# EAGLE design carChargeChannel (EAGLE 7.7.0)

## Sheet 1 of 2
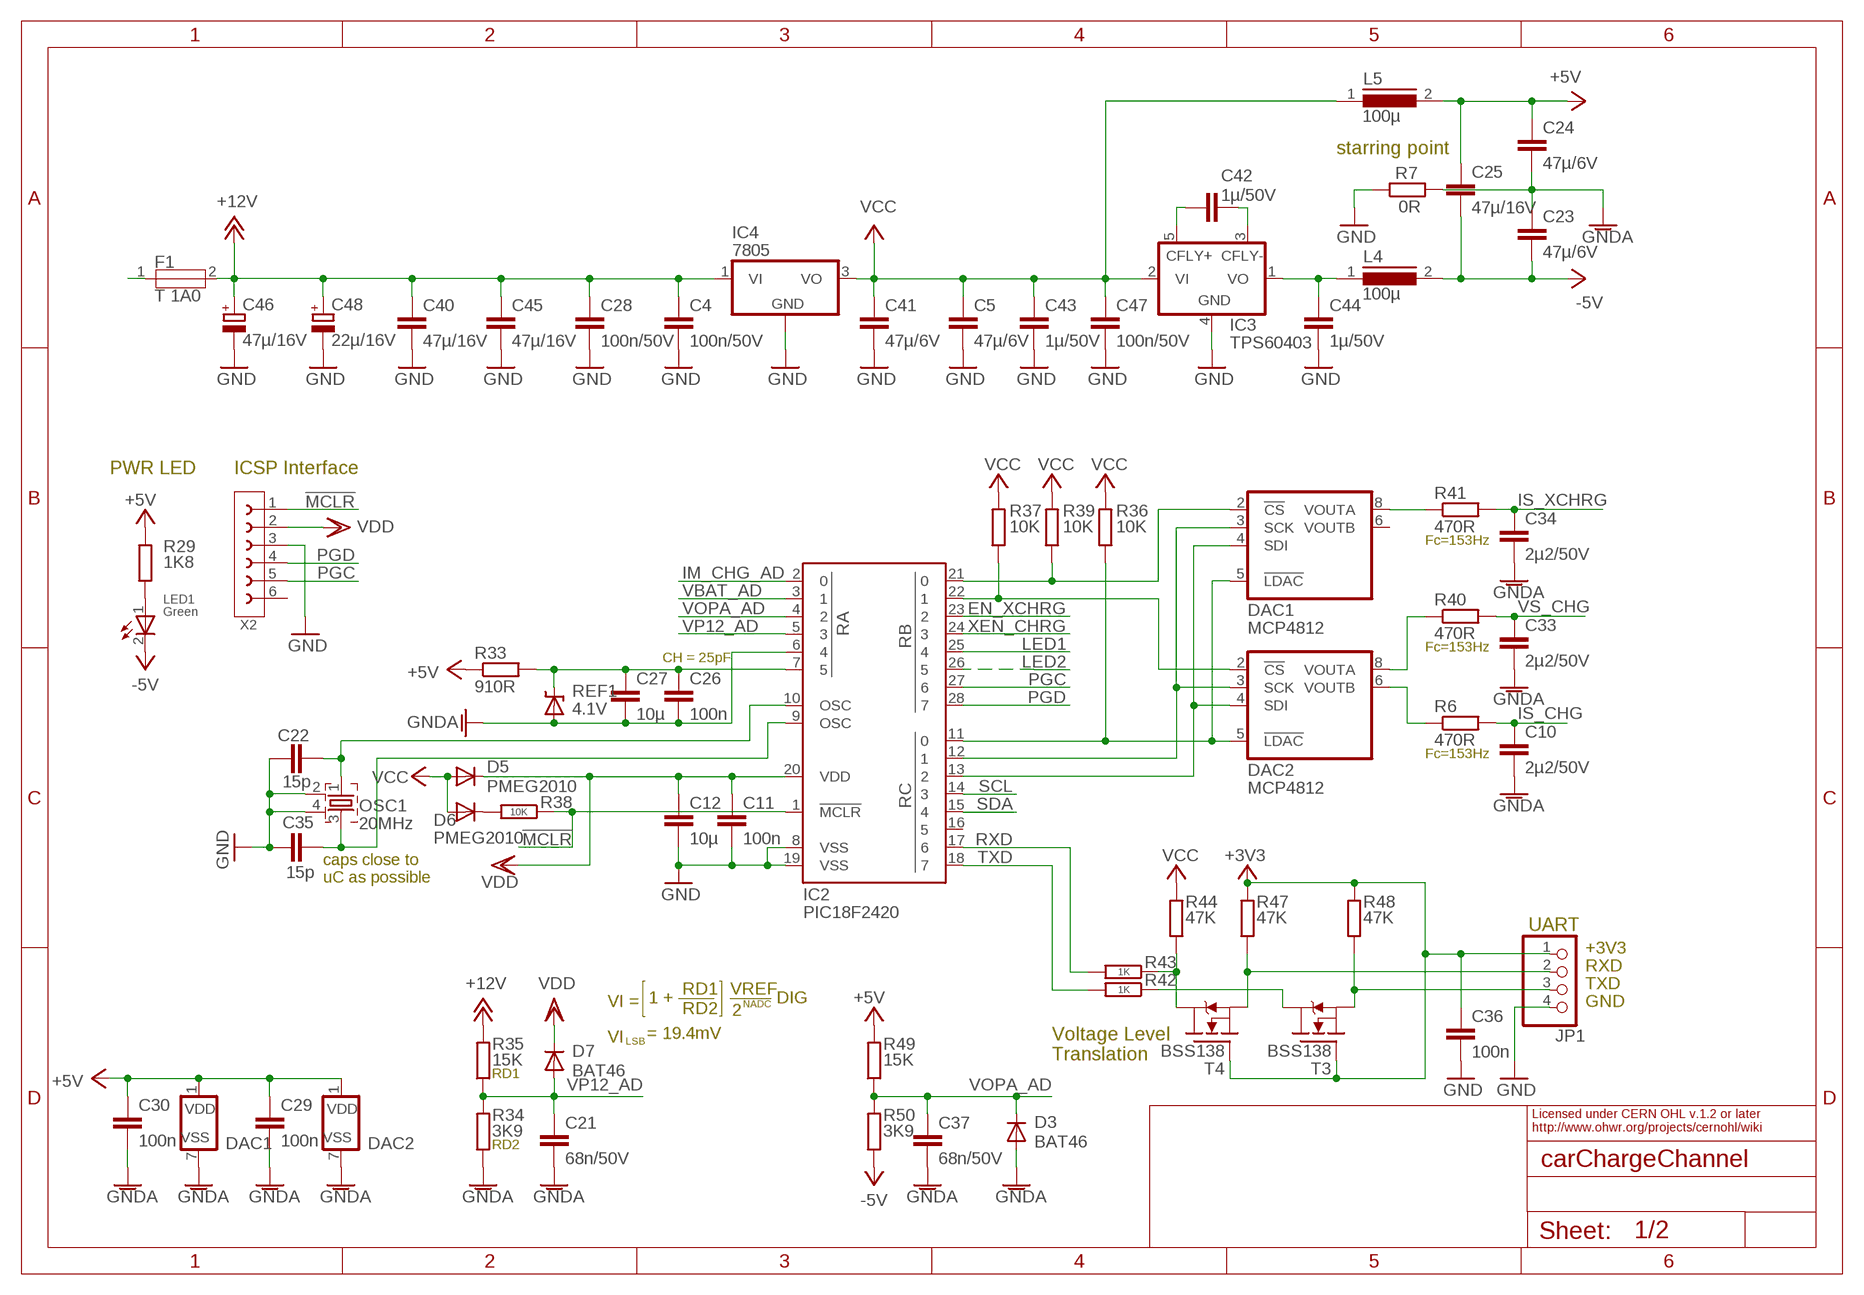
[diagram p0: schematic, sheet 1]

### Parts
C4  100n/50V  X7R-100000P-1206  [1206]
C5  47µ/6V  X5R-47000000P-1206  [1206]
C10  2µ2/50V  X7R-2200000P-1206  [1206]
C11  100n  X7R-100000P-1206  [1206]
C12  10µ  X7R-10000000P-1206  [1206]
C21  68n/50V  X7R-68000P-1206  [1206]
C22  15p  NP0-15P-1206  [1206]
C23  47µ/6V  X5R-47000000P-1206  [1206]
C24  47µ/6V  X5R-47000000P-1206  [1206]
C25  47µ/16V  X5R-47000000P-1210  [1210]
C26  100n  X7R-100000P-1206  [1206]
C27  10µ  X7R-10000000P-1206  [1206]
C28  100n/50V  X7R-100000P-1206  [1206]
C29  100n  X7R-100000P-1206  [1206]
C30  100n  X7R-100000P-1206  [1206]
C33  2µ2/50V  X7R-2200000P-1206  [1206]
C34  2µ2/50V  X7R-2200000P-1206  [1206]
C35  15p  NP0-15P-1206  [1206]
C36  100n  X7R-100000P-1206  [1206]
C37  68n/50V  X7R-68000P-1206  [1206]
C40  47µ/16V  X5R-47000000P-1210  [1210]
C41  47µ/6V  X5R-47000000P-1206  [1206]
C42  1µ/50V  X7R-1000000P-1206  [1206]
C43  1µ/50V  X7R-1000000P-1206  [1206]
C44  1µ/50V  X7R-1000000P-1206  [1206]
C45  47µ/16V  X5R-47000000P-1210  [1210]
C46  47µ/16V  AEC-47U-16V-C  [PANC]
C47  100n/50V  X7R-100000P-1206  [1206]
C48  22µ/16V  AEC-22U-16V-B  [PANB]
D3  BAT46  BAT46W  [SOD123]
D5  PMEG2010  PMEGXX10-20VBEA  [SOD323]
D6  PMEG2010  PMEGXX10-20VBEA  [SOD323]
D7  BAT46  BAT46W  [SOD123]
DAC1  MCP4812  MCP4812-E/MS  [MSOP8]
DAC2  MCP4812  MCP4812-E/MS  [MSOP8]
F1  T 1A0  OMT-T1A0-125V  [OMT125]
IC2  PIC18F2420  PIC18F2420/SO  [SOIC28-7.62]
IC3  TPS60403  TPS60403DBVT  [SOT23-5]
IC4  7805  MC7805D2T  [TO263]
JP1  PINHD-1X4  [1X04]
L4  100µ  LQH3C101K  [1210]
L5  100µ  LQH3C101K  [1210]
LED1  Green  LEDMONO-GREEN-KP3216  [LED3216]
OSC1  20MHz  MT-20000  [MT]
R6  470R  RC1206-470  [1206]
R7  0R  R1206-0.0-1%  [1206]
R29  1K8  R1206-1800-1%  [1206]
R33  910R  R1206-910-1%  [1206]
R34  3K9  R1206-3900-1%  [1206]
R35  15K  R1206-15000-1%  [1206]
R36  10K  R1206-10000-1%  [1206]
R37  10K  R1206-10000-1%  [1206]
R38  10K  R1206-10000-1%  [1206]
R39  10K  R1206-10000-1%  [1206]
R40  470R  RC1206-470  [1206]
R41  470R  RC1206-470  [1206]
R42  1K  R1206-1000-1%  [1206]
R43  1K  R1206-1000-1%  [1206]
R44  47K  R1206-47000-1%  [1206]
R47  47K  R1206-47000-1%  [1206]
R48  47K  R1206-47000-1%  [1206]
R49  15K  R1206-15000-1%  [1206]
R50  3K9  R1206-3900-1%  [1206]
REF1  4.1V  LM4040-4.1V-MF03A  [SOT23]
T3  BSS138  [SOT23]
T4  BSS138  [SOT23]
X2  2X3  BOXHD-06-S-2.54  [BOXHD-06-2.54-S]

### Nets
!CS_DAC1: DAC1.2(!CS) IC2.21 R39.1
!CS_DAC2: DAC2.2(!CS) IC2.22 R37.1
!MCLR: IC2.1(!MCLR) R38.1 X2.1
+3V3: C36.1 JP1.1 R47.2 R48.2 T3.1(G) T4.1(G)
+5V: C24.1 C25.1 C29.1 C30.1 DAC1.1(VDD) DAC2.1(VDD) L5.2 R29.2 R33.1 R49.2 ; also sheet 2
+12V: C4.1 C28.1 C40.1 C45.1 C46.CP(+) C48.CP(+) F1.2 IC4.1(VI) R35.2 ; also sheet 2
-5V: C23.2 C25.2 L4.2 LED1.2(C) R50.1 ; also sheet 2
EN_XCHRG: IC2.23 ; also sheet 2
GND: C4.2 C5.2 C11.2 C12.2 C22.2 C28.2 C35.2 C36.2 C40.2 C41.2 C43.2 C44.2 C45.2 C46.CN(-) C47.2 C48.CN(-) IC2.8(VSS) IC2.19(VSS) IC3.4(GND) IC4.4(GND) JP1.4 OSC1.2 OSC1.4 R7.1 X2.3 ; also sheet 2
GNDA: C10.2 C21.2 C23.1 C24.2 C26.2 C27.2 C29.2 C30.2 C33.2 C34.2 C37.2 D3.A DAC1.7(VSS) DAC2.7(VSS) IC2.6 R7.2 R34.1 REF1.1(A) ; also sheet 2
IM_CHG_AD: IC2.2 ; also sheet 2
IS_CHG: C10.1 R6.2 ; also sheet 2
IS_XCHRG: C34.1 R41.2 ; also sheet 2
LED1: IC2.25 ; also sheet 2
LED2: IC2.26 ; also sheet 2
N$10: DAC1.4(SDI) DAC2.4(SDI) IC2.13
N$20: DAC1.3(SCK) DAC2.3(SCK) IC2.12
N$22: C42.2 IC3.3(CFLY-)
N$28: C42.1 IC3.5(CFLY+)
N$29: DAC2.6(VOUTB) R6.1
N$31: DAC2.8(VOUTA) R40.1
N$32: DAC1.8(VOUTA) R41.1
N$33: C44.1 IC3.1(VO) L4.1
N$34: C35.1 IC2.9(OSC) OSC1.3
N$35: C22.1 IC2.10(OSC) OSC1.1
N$36: LED1.1(A) R29.1
N$37: DAC1.5(!LDAC) DAC2.5(!LDAC) IC2.11 R36.1
N$39: D6.C R38.2
N$40: F1.1
N$45: JP1.3 R48.1 T3.2(S)
N$46: JP1.2 R47.1 T4.2(S)
N$47: R42.1 T3.3(D)
N$48: R43.1 R44.1 T4.3(D)
PGC: IC2.27 X2.5
PGD: IC2.28 X2.4
RXD: IC2.17 R43.2
SCL: IC2.14
SDA: IC2.15
TXD: IC2.18 R42.2
VBAT_AD: IC2.3 ; also sheet 2
VCC: C5.1 C41.1 C43.1 C47.1 D5.A D6.A IC3.2(VI) IC4.3(VO) L5.1 R36.2 R37.2 R39.2 R44.2
VDD: C11.1 C12.1 D5.C D7.C IC2.20(VDD) X2.2
VOPA_AD: C37.1 D3.C IC2.4 R49.1 R50.2
VP12_AD: C21.1 D7.A IC2.5 R34.2 R35.1
VREF_ADC: C26.1 C27.1 IC2.7 R33.2 REF1.2(C)
VS_CHG: C33.1 R40.2 ; also sheet 2
XEN_CHRG: IC2.24 ; also sheet 2
Unconnected: DAC1.6(VOUTB) IC2.16 X2.6

### Notes on the sheet
- starring point
- PWR LED | ICSP Interface
- Fc=153Hz
- Fc=153Hz
- CH = 25pF
- Fc=153Hz
- caps close to
  uC as possible
- UART
- +3V3
- RXD
- TXD
- RD1 | VREF
- VI | = | 1 + | DIG
- NADC | GND
- RD2 | 2
- VI | = 19.4mV
- LSB
- Voltage Level
  Translation
- RD1
- Licensed under CERN OHL v.1.2 or later
  http://www.ohwr.org/projects/cernohl/wiki
- RD2

## Sheet 2 of 2
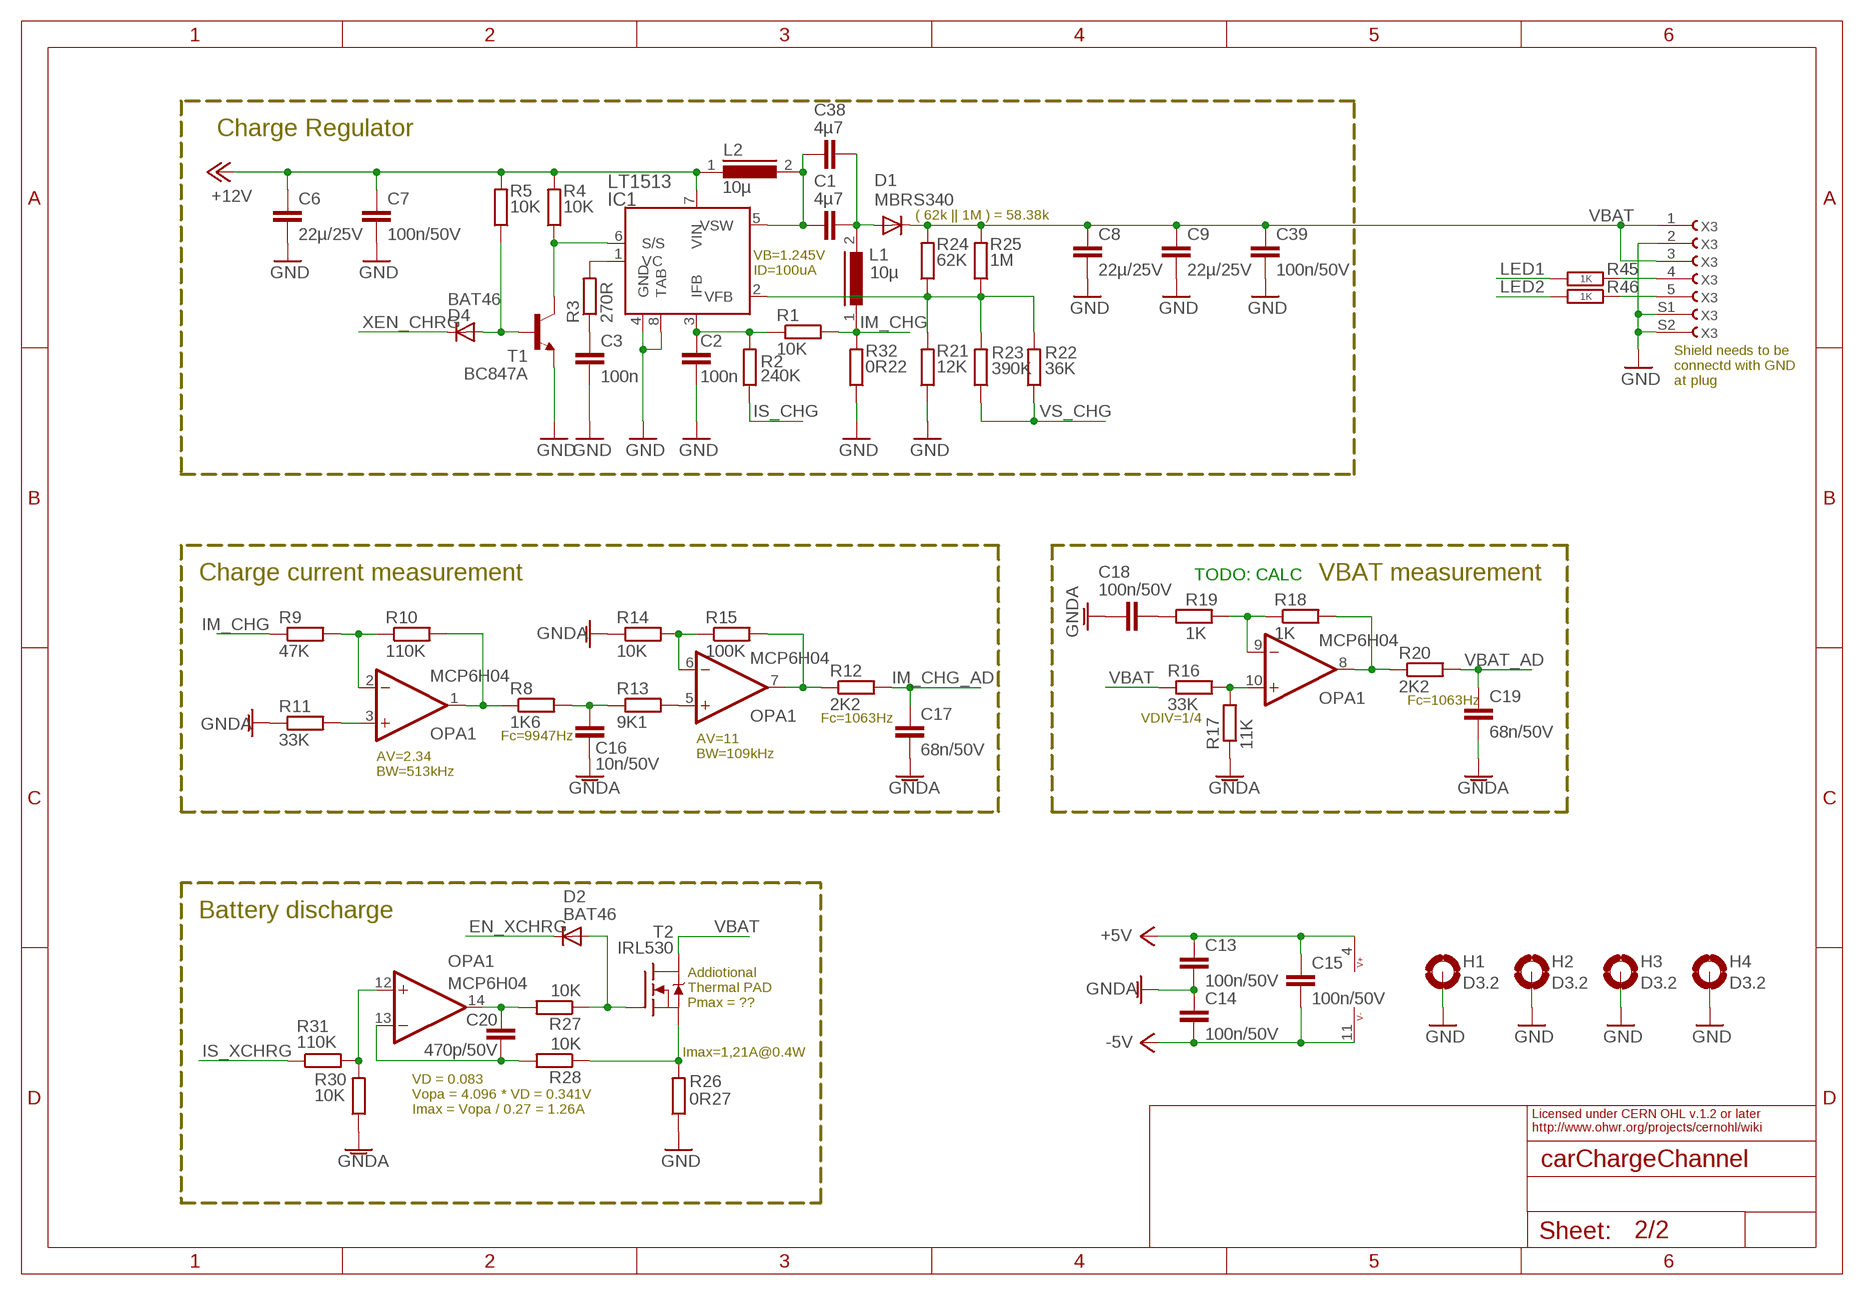
[diagram p1: schematic, sheet 2]

### Parts
C1  4µ7  X7R-4700000P-1206  [1206]
C2  100n  X7R-100000P-1206  [1206]
C3  100n  X7R-100000P-1206  [1206]
C6  22µ/25V  X5R-22000000P-1210  [1210]
C7  100n/50V  X7R-100000P-1206  [1206]
C8  22µ/25V  X5R-22000000P-1210  [1210]
C9  22µ/25V  X5R-22000000P-1210  [1210]
C13  100n/50V  X7R-100000P-1206  [1206]
C14  100n/50V  X7R-100000P-1206  [1206]
C15  100n/50V  X7R-100000P-1206  [1206]
C16  10n/50V  X7R-10000P-1206  [1206]
C17  68n/50V  X7R-68000P-1206  [1206]
C18  100n/50V  X7R-100000P-1206  [1206]
C19  68n/50V  X7R-68000P-1206  [1206]
C20  470p/50V  NP0-470P-1206  [1206]
C38  4µ7  X7R-4700000P-1206  [1206]
C39  100n/50V  X7R-100000P-1206  [1206]
D1  MBRS340  [DO214AB]
D2  BAT46  BAT46W  [SOD123]
D4  BAT46  BAT46W  [SOD123]
H1  D3.2  MOUNT-PAD-ROUND3.2  [3,2-PAD]
H2  D3.2  MOUNT-PAD-ROUND3.2  [3,2-PAD]
H3  D3.2  MOUNT-PAD-ROUND3.2  [3,2-PAD]
H4  D3.2  MOUNT-PAD-ROUND3.2  [3,2-PAD]
IC1  LT1513  LT1513CR  [TO263-7]
L1  10µ  DR-10U-74  [DR74]
L2  10µ  DR-10U-74  [DR74]
OPA1  MCP6H04  [SOIC14]
R1  10K  R1206-10000-1%  [1206]
R2  240K  R1206-240000-1%  [1206]
R3  270R  R1206-270-1%  [1206]
R4  10K  R1206-10000-1%  [1206]
R5  10K  R1206-10000-1%  [1206]
R8  1K6  R1206-1600-1%  [1206]
R9  47K  R1206-47000-1%  [1206]
R10  110K  R1206-110000-1%  [1206]
R11  33K  R1206-33000-1%  [1206]
R12  2K2  R1206-2200-1%  [1206]
R13  9K1  R1206-9100-1%  [1206]
R14  10K  R1206-10000-1%  [1206]
R15  100K  R1206-100000-1%  [1206]
R16  33K  R1206-33000-1%  [1206]
R17  11K  R1206-11000-1%  [1206]
R18  1K  R1206-1000-1%  [1206]
R19  1K  R1206-1000-1%  [1206]
R20  2K2  R1206-2200-1%  [1206]
R21  12K  R1206-12000-1%  [1206]
R22  36K  R1206-36000-1%  [1206]
R23  390K  R1206-390000-1%  [1206]
R24  62K  R1206-62000-1%  [1206]
R25  1M  R1206-1000000-1%  [1206]
R26  0R27  R1206-0.27-5%  [1206]
R27  10K  R1206-10000-1%  [1206]
R28  10K  R1206-10000-1%  [1206]
R30  10K  R1206-10000-1%  [1206]
R31  110K  R1206-110000-1%  [1206]
R32  0R22  R1206-0.22-1%  [1206]
R45  1K  R1206-1000-1%  [1206]
R46  1K  R1206-1000-1%  [1206]
T1  BC847A  [SOT23]
T2  IRL530  IRL530NS  [TO263AB]
X3  DIN5  MAB-5S  [DIN5P]

### Nets
+5V: C13.1 C15.1 OPA1.4(V+) ; also sheet 1
+12V: C6.1 C7.1 IC1.7(VIN) L2.1 R4.2 R5.2 ; also sheet 1
-5V: C14.2 C15.2 OPA1.11(V-) ; also sheet 1
EN_XCHRG: D2.C ; also sheet 1
GND: C2.2 C3.2 C6.2 C7.2 C8.2 C9.2 C39.2 H1.B3,2(MOUNT) H2.B3,2(MOUNT) H3.B3,2(MOUNT) H4.B3,2(MOUNT) IC1.4(GND) IC1.8(TAB) R21.1 R26.1 R32.1 T1.2(E) X3.2 X3.S1 X3.S2 ; also sheet 1
GNDA: C13.2 C14.1 C16.2 C17.2 C18.1 C19.2 R11.1 R14.1 R17.1 R30.1 ; also sheet 1
IM_CHG: L1.1 R1.2 R9.1 R32.2
IM_CHG_AD: C17.1 R12.2 ; also sheet 1
IS_CHG: R2.1 ; also sheet 1
IS_XCHRG: R31.1 ; also sheet 1
LED1: R45.2 ; also sheet 1
LED2: R46.2 ; also sheet 1
N$1: C1.2 C38.2 D1.A L1.2
N$2: C1.1 C38.1 IC1.5(VSW) L2.2
N$3: OPA1.3(+IN) R11.2
N$4: OPA1.8(OUT) R18.2 R20.1
N$5: D4.A R5.1 T1.1(B)
N$6: C3.1 R3.1
N$7: IC1.1(VC) R3.2
N$8: C2.1 IC1.3(IFB) R1.1 R2.2
N$9: IC1.6(S/S) R4.1 T1.3(C)
N$11: OPA1.2(-IN) R9.2 R10.1
N$12: OPA1.1(OUT) R8.1 R10.2
N$13: C16.1 R8.2 R13.1
N$14: OPA1.5(+IN) R13.2
N$15: OPA1.6(-IN) R14.2 R15.1
N$16: OPA1.10(+IN) R16.2 R17.2
N$17: OPA1.7(OUT) R12.1 R15.2
N$18: OPA1.9(-IN) R18.1 R19.2
N$19: C18.2 R19.1
N$21: C20.1 OPA1.14(OUT) R27.2
N$23: D2.A R27.1 T2.1(G)
N$24: OPA1.12(+IN) R30.2 R31.2
N$25: C20.2 OPA1.13(-IN) R28.2
N$26: R26.2 R28.1 T2.3(S)
N$27: IC1.2(VFB) R21.2 R22.2 R23.2 R24.1 R25.1
N$41: R45.1 X3.4
N$42: R46.1 X3.5
VBAT: C8.1 C9.1 C39.1 D1.C R16.1 R24.2 R25.2 T2.4(D) X3.1 X3.3
VBAT_AD: C19.1 R20.2 ; also sheet 1
VS_CHG: R22.1 R23.1 ; also sheet 1
XEN_CHRG: D4.C ; also sheet 1

### Notes on the sheet
- Charge Regulator
- ( 62k || 1M ) = 58.38k
- VB=1.245V
  ID=100uA
- Shield needs to be
  connectd with GND
  at plug
- Charge current measurement | TODO: CALC | VBAT measurement
- Fc=1063Hz
- Fc=1063Hz | VDIV=1/4
- Fc=9947Hz
- AV=11
  BW=109kHz
- AV=2.34
  BW=513kHz
- Battery discharge
- Addiotional
  Thermal PAD
  Pmax = ??
- Imax=1,21A@0.4W
- VD = 0.083
  Vopa = 4.096 * VD = 0.341V
  Imax = Vopa / 0.27 = 1.26A
- Licensed under CERN OHL v.1.2 or later
  http://www.ohwr.org/projects/cernohl/wiki

## Library data of the parts
C1 C38 = omcCapacitor:X7R: X7R Ceramic Capacitors YAGEO Multilayer Capacitors For General Purpose Temperature characteristics: X7R Rated Voltage: 50V Operating Temperature Range: –55°C to +125°C Reichelt Datasheet <http://cdn-reichelt.de/documents/datenblatt/B300/X7R.pdf> MURATA GCM Series High Dielectric Constant Type Murata Datasheet <http://www.murata.com/~/media/webrenewal/support/library/catalog/products/capacitor/mlcc/c03e.ashx> Reichelt Datasheet <http://cdn-reichelt.de/documents/datenblatt/A900/DATASHEET_SMD_0805_1206_1210.pdf>; DIST#REICHELT#: X7R-G1206 4,7/50; VALUE: 4µ7/50V; VENDOR#: MURATA,GCM31CC71H475KA03
C2 C3 C11 C26 C29 C30 C36 = omcCapacitor:X7R: X7R Ceramic Capacitors YAGEO Multilayer Capacitors For General Purpose Temperature characteristics: X7R Rated Voltage: 50V Operating Temperature Range: –55°C to +125°C Reichelt Datasheet <http://cdn-reichelt.de/documents/datenblatt/B300/X7R.pdf> MURATA GCM Series High Dielectric Constant Type Murata Datasheet <http://www.murata.com/~/media/webrenewal/support/library/catalog/products/capacitor/mlcc/c03e.ashx> Reichelt Datasheet <http://cdn-reichelt.de/documents/datenblatt/A900/DATASHEET_SMD_0805_1206_1210.pdf>; DIST#REICHELT#: X7R-G1206 100N; VALUE: 100n/50V; VENDOR#: YAGEO,12062R104K9BP0D
C4 C7 C13-C15 C18 C28 C39 C47 = omcCapacitor:X7R: X7R Ceramic Capacitors YAGEO Multilayer Capacitors For General Purpose Temperature characteristics: X7R Rated Voltage: 50V Operating Temperature Range: –55°C to +125°C Reichelt Datasheet <http://cdn-reichelt.de/documents/datenblatt/B300/X7R.pdf> MURATA GCM Series High Dielectric Constant Type Murata Datasheet <http://www.murata.com/~/media/webrenewal/support/library/catalog/products/capacitor/mlcc/c03e.ashx> Reichelt Datasheet <http://cdn-reichelt.de/documents/datenblatt/A900/DATASHEET_SMD_0805_1206_1210.pdf>; DIST#REICHELT#: X7R-G1206 100N; VENDOR#: YAGEO,12062R104K9BP0D
C5 C23 C24 C41 = omcCapacitor:X5R: X5R Ceramic Capacitors Murate GRM Series For General Purpose Temperature characteristics: X5R Size: 0.4×0.2mm to 5.7×5.0mm Rated Voltage: DC2.5V to 3.15kV Operating Temperature Range: –55°C to +85°C Product Side <http://psearch.en.murata.com/capacitor/lineup/grm> Murata Datasheet <http://www.murata.com/~/media/webrenewal/support/library/catalog/products/capacitor/mlcc/c02e.ashx> Distributor Reichelt: avialable Conrad: avialable Digi-Key: -; DIST#REICHELT#: X5R-G1206 47/6; VENDOR#: MURATA,GRM31CR60J476ME19#
C6 C8 C9 = omcCapacitor:X5R: X5R Ceramic Capacitors Murate GRM Series For General Purpose Temperature characteristics: X5R Size: 0.4×0.2mm to 5.7×5.0mm Rated Voltage: DC2.5V to 3.15kV Operating Temperature Range: –55°C to +85°C Product Side <http://psearch.en.murata.com/capacitor/lineup/grm> Murata Datasheet <http://www.murata.com/~/media/webrenewal/support/library/catalog/products/capacitor/mlcc/c02e.ashx> Distributor Reichelt: avialable Conrad: avialable Digi-Key: -; DIST#REICHELT#: X5R-G1210 22; VENDOR#: MURATA,GRM32ER61E226ME15#
C10 C33 C34 = omcCapacitor:X7R: X7R Ceramic Capacitors YAGEO Multilayer Capacitors For General Purpose Temperature characteristics: X7R Rated Voltage: 50V Operating Temperature Range: –55°C to +125°C Reichelt Datasheet <http://cdn-reichelt.de/documents/datenblatt/B300/X7R.pdf> MURATA GCM Series High Dielectric Constant Type Murata Datasheet <http://www.murata.com/~/media/webrenewal/support/library/catalog/products/capacitor/mlcc/c03e.ashx> Reichelt Datasheet <http://cdn-reichelt.de/documents/datenblatt/A900/DATASHEET_SMD_0805_1206_1210.pdf>; DIST#REICHELT#: X7R-G1206 2,2/50; VENDOR#: MURATA,GCM31CR71H225KA55
C12 C27 = omcCapacitor:X7R: X7R Ceramic Capacitors YAGEO Multilayer Capacitors For General Purpose Temperature characteristics: X7R Rated Voltage: 50V Operating Temperature Range: –55°C to +125°C Reichelt Datasheet <http://cdn-reichelt.de/documents/datenblatt/B300/X7R.pdf> MURATA GCM Series High Dielectric Constant Type Murata Datasheet <http://www.murata.com/~/media/webrenewal/support/library/catalog/products/capacitor/mlcc/c03e.ashx> Reichelt Datasheet <http://cdn-reichelt.de/documents/datenblatt/A900/DATASHEET_SMD_0805_1206_1210.pdf>; DIST#REICHELT#: X7R-G1206 10/16; VALUE: 10µ/16V; VENDOR#: MURATA,GCM31CR71C106KA64
C16 = omcCapacitor:X7R: X7R Ceramic Capacitors YAGEO Multilayer Capacitors For General Purpose Temperature characteristics: X7R Rated Voltage: 50V Operating Temperature Range: –55°C to +125°C Reichelt Datasheet <http://cdn-reichelt.de/documents/datenblatt/B300/X7R.pdf> MURATA GCM Series High Dielectric Constant Type Murata Datasheet <http://www.murata.com/~/media/webrenewal/support/library/catalog/products/capacitor/mlcc/c03e.ashx> Reichelt Datasheet <http://cdn-reichelt.de/documents/datenblatt/A900/DATASHEET_SMD_0805_1206_1210.pdf>; DIST#REICHELT#: X7R-G1206 10N; VENDOR#: YAGEO,12062R103K9BP0D
C17 C19 C21 C37 = omcCapacitor:X7R: X7R Ceramic Capacitors YAGEO Multilayer Capacitors For General Purpose Temperature characteristics: X7R Rated Voltage: 50V Operating Temperature Range: –55°C to +125°C Reichelt Datasheet <http://cdn-reichelt.de/documents/datenblatt/B300/X7R.pdf> MURATA GCM Series High Dielectric Constant Type Murata Datasheet <http://www.murata.com/~/media/webrenewal/support/library/catalog/products/capacitor/mlcc/c03e.ashx> Reichelt Datasheet <http://cdn-reichelt.de/documents/datenblatt/A900/DATASHEET_SMD_0805_1206_1210.pdf>; DIST#REICHELT#: X7R-G1206 68N; VENDOR#: YAGEO,12062R683K9BP0D
C20 = omcCapacitor:NP0: NP0 Surface-Mount Ceramic Multilayer Capacitors YAGEO Multilayer Capacitors For General Purpose RoHS compliant Rated Voltage: 50V Operating Temperature Range: –55°C to +125°C Yageo Datasheet <http://www.yageo.com/documents/recent/UPY-GP_NP0_16V-to-50V_8.pdf> Distributor Reichelt: avialable Conrad: avialable Digi-Key: -; DIST#REICHELT#: NPO-G1206 470P; VENDOR#: YAGEO#1206CG471J9BP
C22 C35 = omcCapacitor:NP0: NP0 Surface-Mount Ceramic Multilayer Capacitors YAGEO Multilayer Capacitors For General Purpose RoHS compliant Rated Voltage: 50V Operating Temperature Range: –55°C to +125°C Yageo Datasheet <http://www.yageo.com/documents/recent/UPY-GP_NP0_16V-to-50V_8.pdf> Distributor Reichelt: avialable Conrad: avialable Digi-Key: -; DIST#REICHELT#: NPO 1206 BK 15P; VALUE: 15p/630V; VENDOR#: RND,15pF
C25 C40 C45 = omcCapacitor:X5R: X5R Ceramic Capacitors Murate GRM Series For General Purpose Temperature characteristics: X5R Size: 0.4×0.2mm to 5.7×5.0mm Rated Voltage: DC2.5V to 3.15kV Operating Temperature Range: –55°C to +85°C Product Side <http://psearch.en.murata.com/capacitor/lineup/grm> Murata Datasheet <http://www.murata.com/~/media/webrenewal/support/library/catalog/products/capacitor/mlcc/c02e.ashx> Distributor Reichelt: avialable Conrad: avialable Digi-Key: -; DIST#REICHELT#: X5R-G1210 47; VENDOR#: MURATA,GRM32ER61C476ME15#
C42-C44 = omcCapacitor:X7R: X7R Ceramic Capacitors YAGEO Multilayer Capacitors For General Purpose Temperature characteristics: X7R Rated Voltage: 50V Operating Temperature Range: –55°C to +125°C Reichelt Datasheet <http://cdn-reichelt.de/documents/datenblatt/B300/X7R.pdf> MURATA GCM Series High Dielectric Constant Type Murata Datasheet <http://www.murata.com/~/media/webrenewal/support/library/catalog/products/capacitor/mlcc/c03e.ashx> Reichelt Datasheet <http://cdn-reichelt.de/documents/datenblatt/A900/DATASHEET_SMD_0805_1206_1210.pdf>; DIST#REICHELT#: X7R-G1206 1,0/50; VENDOR#: MURATA,GCM31MR71H105KA55
C46 = omcCapacitor:AEC: Aluminum Electrolytic Capacitors Panasonic - FC/FK Series: Life time: 105°C 1000 h Operating temperature range: -40 to + 105°C Voltage rating: 6.3 to 50 VDC Capacitance range: 1µF to 1500µF Panasonic Productside <http://industrial.panasonic.com/ww/products/capacitors/aluminum-capacitors/aluminum-cap-smd> Panasonic Datasheet <http://industrial.panasonic.com/cdbs/www-data/pdf/RDE0000/DME0000COL51.pdf> Reichelt Datasheet <http://cdn-reichelt.de/documents/datenblatt/B300/Al-SMD_FCneu.pdf> Distributor Reichelt: avialable Conrad: avialable Digi-Key: -; DIST#REICHELT#: VF 47/16 P-C; ESR: 0R36; I_RIPPLE: 240m; VENDOR#: PANASONIC#EEEFK1C470AP
C48 = omcCapacitor:AEC: Aluminum Electrolytic Capacitors Panasonic - FC/FK Series: Life time: 105°C 1000 h Operating temperature range: -40 to + 105°C Voltage rating: 6.3 to 50 VDC Capacitance range: 1µF to 1500µF Panasonic Productside <http://industrial.panasonic.com/ww/products/capacitors/aluminum-capacitors/aluminum-cap-smd> Panasonic Datasheet <http://industrial.panasonic.com/cdbs/www-data/pdf/RDE0000/DME0000COL51.pdf> Reichelt Datasheet <http://cdn-reichelt.de/documents/datenblatt/B300/Al-SMD_FCneu.pdf> Distributor Reichelt: avialable Conrad: avialable Digi-Key: -; DIST#REICHELT#: VF 22/16 P-B; ESR: 1R8; I_RIPPLE: 95m; VENDOR#: PANASONIC#EEEFC1C220R
D1 = omcDiode:MBRS3: MBRS3X0 - 3A Schottky Power Rectifier Schottky barrier rectifiers 3A 20V, 30V, 40V, 60V SMC 403-03 (DO214AB) Package Fairchild MBRS320 Datasheet <https://www.fairchildsemi.com/datasheets/MB/MBRS320.pdf> Fairchild MBRS340 Datasheet <https://www.fairchildsemi.com/datasheets/MB/MBRS340.pdf> Fairchild MBRS360 Datasheet <https://www.fairchildsemi.com/datasheets/MB/MBRS360.pdf> Reichelt Datasheet <http://cdn-reichelt.de/documents/datenblatt/A400/MBRS340_MBRS320_MBRS360%23ON.pdf> MAXIMUM RATINGS AND ELECTRICAL CHARACTERISTICS Characteristics MBRS320 MBRS330 MBRS340 MBRS360 Unit Peak Repetitive Reverse Voltage 20 30 40 60 V Average Rectified Forward Current 3.0 @100°C 4.0 @90°C A Nonrepetitive Peak Surge Current 80 A Operating Junction Temperature – 65 to +125 °C Thermal Resistance — Junction to Lead 11 °C/W Maximum Instantaneous Forward Voltage (IF = 3.0 A, TJ = 25°C)) 0.500 0.500 0.525 0.740 V Maximum Instantaneous Reverse Current Rated dc Voltage, TJ = 25°C Rated dc Voltage, TJ = 100°C 2.0 20 2.0 20 2.0 20 0.5 20 mA; DIST#REICHELT#: MBRS 340 SMD; VENDOR#: ON Semiconductor,MBRS340T3
D2-D4 D7 = omcDiode:BAT46: BAT46 - Schottky Diode metal to silicon diode high breakdown low turn-on voltage Temperature: -65°C...125°C BAT46W 100V/0.15A SOD123 Package Diodes Incorporated Datasheet <http://www.diodes.com/_files/datasheets/ds30044.pdf> Reichelt Datasheet <http://cdn-reichelt.de/documents/datenblatt/A400/BAT46W.pdf> TMMBAT46 30V/0.2A Minimelf Package ST Microelectronics Datasheet <http://www.st.com/web/en/resource/technical/document/datasheet/CD00000815.pdf> Reichelt Datasheet <http://cdn-reichelt.de/documents/datenblatt/A400/BAT46.pdf> BAT46 100V/0.15A DO35 Package Vishay Datasheet <http://www.vishay.com/docs/85662/bat46.pdf> Reichelt Datasheet <http://cdn-reichelt.de/documents/datenblatt/A400/BAT46_VIS.pdf>; DIST#REICHELT#: BAT 46W; VENDOR#: DIODES,BAT46W-7-F
D5 D6 = omcDiode:PMEGXX10: PMEGXX10 - 1A very low VF MEGA Schottky barrier rectifier - NXP Schottky Forward current: 1 A Reverse voltages: 20V, 30V, 40V Very low forward voltage Datasheet: Nexperia <https://assets.nexperia.com/documents/data-sheet/PMEGXX10BEA_PMEGXX10BEV.pdf> Reichelt <https://cdn-reichelt.de/documents/datenblatt/A400/PMEG4010BEA_ENG_TDS.pdf>; VENDOR#: NXP,PMEG2010BEA
DAC1 DAC2 = omcAD:MCP48: MCP4802/4812/4822 - 8/10/12-Bit Dual Voltage Output Digital-to-Analog Converter with Internal VREF and SPI Interface - Mircochip MCP802: Dual 8-Bit Voltage Output DAC MCP4812: Dual 10-Bit Voltage Output DAC MCP4822: Dual 12-Bit Voltage Output DAC Rail-to-Rail Output SPI Interface with 20 MHz Clock Support Simultaneous Latching of the Dual DACs with LDAC pin Fast Settling Time of 4.5 μs 2.048V Internal Voltage Reference 50ppm/°C VREF Temperature Coefficient 2.7V to 5.5V Single-Supply Operation Extended Temperature Range: -40°C to +125°C Datasheet: Microchip <http://ww1.microchip.com/downloads/en/devicedoc/20002249b.pdf> Reichelt <https://cdn-reichelt.de/documents/datenblatt/A200/MCP4802-4812-4822.pdf>; DIST#REIHCELT#: MCP 4812-E/MS; VENDOR#: Microchip,MCP4812-E/MS
F1 = omcFuse:OMT: OMT - Non resettable SMD Fuse Describtion Directly solderable on printed circuit boards Standards UL 248-14 CSA C22.2 no. 248.14 Approvals UL File Number: E41599 Technical Data Type OMT125 OMT250 Rated Voltage 125 VAC/DC 125 - 250VAC, 125 VDC Rated Current 0.25 - 5 A 0.75 - 5A Breaking Capacity 100 A 50A - 100A Characteristic Time-Lag T Time-Lag T Mounting PCB,SMT Admissible Ambient Air Temp. -40 °C to 85 °C Climatic Category 40/085/21 acc. to IEC 60068-1 Material: Housing Thermoplastic, UL 94V-0 Material: Terminals Tin-Plated Copper Alloy Datasheet Schurter <http://www.schurter.ch/bundles/snceschurter/epim/_ProdPool_/newDS/de/typ_OMT_125.pdf> Reichelt <http://cdn-reichelt.de/documents/datenblatt/C400/typ_OMT_125.pdf> Schurter <http://www.schurter.ch/bundles/snceschurter/epim/_ProdPool_/newDS/de/typ_OMT.pdf> Reichelt <http://cdn-reichelt.de/documents/datenblatt/C400/OMT.pdf> Distributor Reichelt: avialable Conrad: Digi-Key:; DIST#REICHELT#: OMT 125 1,0A; VENDOR#: Schurter,3404.0114.11
H1-H4 = holes:MOUNT-PAD-ROUND: MOUNTING PAD, round
IC1 = omcPwrSupply:LT1513: Linear Technology -LT1513 - Programmable-Current/Constant-Voltage Battery Charger Charger Input Voltage May Be Higher, Equal to or Lower Than Battery Voltage Charges Any Number of Cells Up to 20V 1% Voltage Accuracy for Rechargeable Lithium Batteries 100mV Current Sense Voltage for High Efficiency (LT1513) 0mV Current Sense Voltage for Easy Current Programming (LT1513-2) Battery Can Be Directly Grounded 500kHz Switching Frequency Minimizes Inductor Size Charging Current Easily Programmable or Shut Down Datasheet: Linear Technology <https://www.analog.com/media/en/technical-documentation/data-sheets/1513fas.pdf> Mouser <https://www.mouser.de/datasheet/2/609/1513fas-1270311.pdf>; #VENDOR: Linear Technology, LT1513CR; DIST#MOUSER#: 584-LT1513CR#PBF
IC2 = omcPIC:PIC18F2420: PIC18F2420 - 28-Pin High-Performance, Enhanced Flash MCUs with 10-bit A/D and nanoWatt Technologys Power Management Features: Run: CPU on, peripherals on Idle: CPU off, peripherals on Sleep: CPU off, peripherals off Ultra Low 50nA Input Leakage Run mode Currents Down to 11 μA Typical Idle mode Currents Down to 2.5 μA Typical Sleep mode Current Down to 100 nA Typical Timer1 Oscillator: 900 nA, 32 kHz, 2V Watchdog Timer: 1.4 μA, 2V Typical Two-Speed Oscillator Start-up Flexible Oscillator Structure: Four Crystal modes, up to 40 MHz 4x Phase Lock Loop (PLL) – Available for Crystal and Internal Oscillators Two External RC modes, up to 4 MHz Two External Clock modes, up to 40 MHz Internal oscillator block: Fast wake from Sleep and Idle, 1 μs typical 8 use-selectable frequencies, from 31 kHz to 8 MHz Provides a complete range of clock speeds from 31 kHz to 32 MHz when used with PLL User-tunable to compensate for frequency drift Secondary Oscillator using Timer1 @ 32 kHz Fail-Safe Clock Monitor Allows for safe shutdown if peripheral clock stops Peripheral Highlights: High current sink/source 25 mA/25 mA Three Programmable External Interrupts Four Input Change Interrupts Up to 2 Capture/Compare/PWM (CCP) modules, one with Auto-Shutdown (28-pin devices) Enhanced Capture/Compare/PWM (ECCP) module: One, two or four PWM outputs Selectable polarity Programmable dead time Auto-Shutdown and Auto-Restart Compatible 10-bit, up to 13-channel Analog-to-Digital Converter module (A/D) with programmable acquisition time Enhanced USART module: Supports RS-485, RS-232 and LIN 1.2 Auto-Wake-up on Start bit Auto-Baud Detect Master Synchronous Serial Port (MSSP) module Supporting 3-Wire SPI (all 4 modes) and I2C Master and Slave modes Enhanced Addressable USART module: Supports RS-485, RS-232 and LIN/J2602 RS-232 operation using internal oscillator block (no external crystal required) Auto-Baud Detect 10-Bit, up to 13-Channel Analog-to-Digital (A/D) Converter module: Auto-acquisition capability Conversion available during Sleep Dual Analog Comparators with Input Multiplexing Programmable 16-Level High/Low-Voltage Detection (HLVD) module: Supports interrupt on High/Low-Voltage Detection Special Microcontroller Features: C Compiler Optimized Architecture: Optional extended instruction set designed to optimize re-entrant code 100,000 erase/write cycle Enhanced Flash program memory typical 1,000,000 erase/write cycle Data EEPROM memory typical Flash/Data EEPROM Retention: 100 Years Typical Self-programmable under software control Priority levels for interrupts 8 x 8 Single-Cycle Hardware Multiplier Extended Watchdog Timer (WDT): Programmable period from 4 ms to 131s Single-supply 5V In-Circuit Serial Programming™ (ICSP™) via two pins In-Circuit Debug (ICD) via two pins Wide operating voltage range: 2.0V to 5.5V Programmable Brown-out Reset (BOR) with Software Enable Option Datasheet: Microchip <https://ww1.microchip.com/downloads/en/DeviceDoc/39631E.pdf> Reichelt <https://cdn-reichelt.de/documents/datenblatt/A300/PIC18F2420_2520_4420_4520.pdf>; DIST#REICHELT: PIC 18F2420-I/SO; VENDOR: Microchip,PIC18F2420-I/SO
IC3 = omcPwrSupply:TPS6040: TI - TPS6040x - Unregulated 60-mA Charge Pump Voltage Inverter Inverts Input Supply Voltage Up to 60-mA Output Current Only Three Small 1-µF Ceramic Capacitors typically supplied by a preregulated supply rail of 5V Needed Input Voltage Range From 1.6V to 5.5V PowerSave-Mode for Improved Efficiency at LowOutput Currents (TPS60400) Device Quiescent Current Typical 65 µA Integrated Active Schottky-Diode for Start-up Into Load Small 5-Pin SOT-23 Package Datasheet: TI <http://www.ti.com/lit/ds/symlink/tps60403.pdf> Reichelt <https://cdn-reichelt.de/documents/datenblatt/A200/TPS6040X-TI.pdf>; DIST#REICHELT: TPS 60403 DBVT; VENDOR#: TI,TPS60403DBVT
IC4 = omcPwrSupply:MC78: MC78XX - 1.0 A Positive Voltage Regulators - On Semiconductor Output Current in Excess of 1.0 A No External Components Required Internal Thermal Overload Protection Internal Short Circuit Current Limiting Output Transistor Safe-Area Compensation Output Voltage Offered in 1.5%, 2% and 4% Tolerance Datasheet: On Semiconductor <https://www.onsemi.com/pub/Collateral/MC7800-D.PDF> Reichelt <https://cdn-reichelt.de/documents/datenblatt/A200/MC78XX-ON.pdf>; DIST#REICHELT: MC 7805 CD2TG; VENDOR#: On Semiconductor, MC7824CD2TG
JP1 = pinhead:PINHD-1X4: PIN HEADER
L1 L2 = omcInductor:DR-: Eaton Coiltronics DR Series Inductance range from 0.33μH to 1000μH Current range up to 56 amps peak Magnetic shielding Ferrite core material Mounting: SMD Material: Ferrite Datasheet: Eaton <https://www.eaton.com/content/dam/eaton/products/electronic-components/resources/data-sheet/eaton-dr-high-power-density-high-efficiency-shielded-drum-core-power-inductors-data-sheet.pdf> Reichelt <https://cdn-reichelt.de/documents/datenblatt/B300/DR-SERIES_ENG_TDS.pdf>; #VENDOR: Coiltronics,DR74-100-R; DCR: 0.0489R; DIST#REICHELT: EATON DR74-100-R; I_SAT: 3.41A; I_TYP: 2.41A
L4 L5 = omcInductor:LQH3C: LQH3C - Chip Coils for Choke Wire Wound Type Inductance: 1µH - 560µH Current: 60mA - 1A Temperature: -25°C - 85°C Mounting: 1210 SMD Material: Ferrite Murata Datasheet <http://www.murata.com/~/media/webrenewal/support/library/catalog/products/inductor/chip/o05e.ashx> Reichelt Datasheet <http://cdn-reichelt.de/documents/datenblatt/B400/LQH.pdf> Inductance L [µH] fTest [MHz] Self-resonant-Frequency [MHz] DC Resistance [Ω] Allowed Current [mA] Typ. Min. 1.0 1 150 96 0.09±30% 800 2.2 1 100 64 0.13±30% 600 4.7 1 66 43 0.20±30% 450 10 1 40 26 0.44±30% 300 22 1 27 19 0.71±30% 250 47 1 19 15 1.3±30% 170 100 1 13 10 3.5±30% 100 220 1 8.5 6.8 8.4±30% 70 330 1 7.0 5.6 10.0±30% 60 390 1 6.6 5.0 17.0±30% 60 470 0.001 6.2 5.0 19.0±30% 60 560 0.001 5.7 5.0 22.0±30% 60 Distributor Reichelt: LQH3C XXµ Conrad: avialable Digi-Key: -; DIST#REICHELT#: LQH3C 100µ; VENDOR#: Murata,LGH3C101K34
LED1 = omcOpto:LEDMONO: LED Monochromatic Knighbright (KP3216) 3.2x1.6mm (1206) SMD chip LED lamps operating temperature: -40 to +85 °C Reichelt Datasheet (Red/Green/Yellow) <http://cdn-reichelt.de/documents/datenblatt/A500/KP-3216SERIES.pdf> Reichelt Datasheet (Blue) <http://cdn-reichelt.de/documents/datenblatt/A500/KP-3216QBC-D.pdf> Knighbright (KP2012) 2.0x1.25mm (0805) SMD chip LED lamps Conrad Datasheet <http://www.produktinfo.conrad.com/datenblaetter/1000000-1099999/001050393-da-01-en-SMD_CHIPLED_OR_0805_KP_2012SECK.pdf> Knighbright (KP1608) SMD 0603 1.6mm x 0.8mm SMD LED Datasheet Color: Blue [Conrad] <http://www.produktinfo.conrad.com/datenblaetter/1000000-1099999/001050379-da-01-en-SMD_CHIPLED_BL_0603_KP_1608QBC_D.pdf> Green [Conrad] <http://www.produktinfo.conrad.com/datenblaetter/1000000-1099999/001050377-da-01-en-SMD_CHIPLED_GR_0603_KP_1608CGCK.pdf> Orange [Conrad] <http://www.produktinfo.conrad.com/datenblaetter/1000000-1099999/001050375-da-01-en-SMD_CHIPLED_OR_0603_KP_1608SECK.pdf> Red [Conrad] <http://www.produktinfo.conrad.com/datenblaetter/1000000-1099999/001050374-da-01-en-SMD_CHIPLED_ROT_0603_KP_1608SURCK.pdf> Yellow [Conrad] <http://www.produktinfo.conrad.com/datenblaetter/1000000-1099999/001050376-da-01-en-SMD_CHIPLED_GE_0603_KP_1608SYCK.pdf> Everlight (2521) 3.2x1.6mm (1206) SMD chip LED lamps Reichelt Datasheet (Orange) <http://cdn-reichelt.de/documents/datenblatt/A500/15-21-S2C-AQ2R2B.pdf> Reichelt Datasheet (White) <http://cdn-reichelt.de/documents/datenblatt/A500/15-21-T7D-JQ2S1PY.pdf> Lucky Light (S172) 2.0x1.25mm (0805) SMD chip LED lamps Reichelt Datasheet (White) <http://cdn-reichelt.de/documents/datenblatt/A500/S172W-W2-1C.pdf>; DIST#REICHELT#: SMD-LED 1206 GN; VENDOR#: Kingbright,KP-3216SGD
OPA1 = omcOpAmp:MCP6H04: MCP6H02 - 1.2 MHz, 16V Op Amps - Microchip Input Offset Voltage: ±0.7 mV (typical) Quiescent Current: 135 μA (typical) Common Mode Rejection Ratio: 100 dB (typical) Power Supply Rejection Ratio: 102 dB (typical) Rail-to-Rail Output Supply Voltage Range:: Single-Supply Operation: 3.5V to 16V Dual-Supply Operation: ±1.75V to ±8V Gain Bandwidth Product: 1.2 MHz (typical) Slew Rate: 0.8V/μs (typical) Unity Gain Stable Extended Temperature Range: -40°C to +125°C No Phase Reversal Datasheet: Microchip <http://ww1.microchip.com/downloads/en/devicedoc/22243d.pdf> Reichelt <https://cdn-reichelt.de/documents/datenblatt/A200/MCP6H01-2-4.pdf>; DIST#REICHELT#: MCP 6H04-E/SL; VENDOR#: Microchip,MCP6H04E
OSC1 = omcResonator:MT: MT CRYSTALS - 12.0MHz to 60MHz Frequency range 12MHz to 60MHz, fundamental mode Ultra-small package 3.2mm x 2.5mm x 0.6mm Ideal for PDAs, hand-held GPS, PCMCIA Euro Quartz Website <http://www.euroquartz.co.uk/products/mt-crystals/> Euro Quartz Datasheet <http://www.euroquartz.co.uk/media/1904/mt.pdf> Reichelt Datasheet <http://cdn-reichelt.de/documents/datenblatt/B400/MT.pdf>; DIST#REICHELT#: 20,000000-MT; VENDOR#: Euroquartz,MT-20000-12
R1 R4 R5 R14 R27 R28 R30 R36-R39 = omcResistor:R1206: YAGEO RC1206 - General Purpose Chip Resistors Power dissipation: 0.250W 5% Tolerance E96 Series Operating Temperature Range: –55°C to +155°C Maximum Working Voltage: 200V Maximum Overload Voltage: 400V Temperature Coefficient: 10Ω< R≤10MΩ: ±100 ppm/°C R≤10Ω || R>10 MΩ: ±200 ppm/°C Jumper Criteria Rated Current: 2A Maximum Current: 10A Yageo Datasheet <http://www.yageo.ru/pdf/RC1206.pdf> Reichelt Datasheet <http://cdn-reichelt.de/documents/datenblatt/A900/SMD_1206.pdf>; DIST#REICHELT#: RND 1 10K; PMAX: 125mW
R2 = omcResistor:R1206: YAGEO RC1206 - General Purpose Chip Resistors Power dissipation: 0.250W 5% Tolerance E96 Series Operating Temperature Range: –55°C to +155°C Maximum Working Voltage: 200V Maximum Overload Voltage: 400V Temperature Coefficient: 10Ω< R≤10MΩ: ±100 ppm/°C R≤10Ω || R>10 MΩ: ±200 ppm/°C Jumper Criteria Rated Current: 2A Maximum Current: 10A Yageo Datasheet <http://www.yageo.ru/pdf/RC1206.pdf> Reichelt Datasheet <http://cdn-reichelt.de/documents/datenblatt/A900/SMD_1206.pdf>; DIST#REICHELT#: RND 1 240K; PMAX: 125mW
R3 = omcResistor:R1206: YAGEO RC1206 - General Purpose Chip Resistors Power dissipation: 0.250W 5% Tolerance E96 Series Operating Temperature Range: –55°C to +155°C Maximum Working Voltage: 200V Maximum Overload Voltage: 400V Temperature Coefficient: 10Ω< R≤10MΩ: ±100 ppm/°C R≤10Ω || R>10 MΩ: ±200 ppm/°C Jumper Criteria Rated Current: 2A Maximum Current: 10A Yageo Datasheet <http://www.yageo.ru/pdf/RC1206.pdf> Reichelt Datasheet <http://cdn-reichelt.de/documents/datenblatt/A900/SMD_1206.pdf>; DIST#REICHELT#: RND 1 270; PMAX: 125mW
R6 R40 R41 = omcResistor:RC1206: YAGEO RC1206 - General Purpose Chip Resistors Power dissipation: 0.250W 1% Tolerance E96 Series Operating Temperature Range: –55°C to +155°C Maximum Working Voltage: 200V Maximum Overload Voltage: 400V Temperature Coefficient: 10Ω< R≤10MΩ: ±100 ppm/°C R≤10Ω || R>10 MΩ: ±200 ppm/°C Jumper Criteria Rated Current: 2A Maximum Current: 10A Yageo Datasheet <http://www.yageo.ru/pdf/RC1206.pdf> Reichelt Datasheet <http://cdn-reichelt.de/documents/datenblatt/A900/SMD_1206.pdf> Distributor Reichelt: E24 Conrad: avialable Digi-Key: -; DIST#REICHELT#: SMD 1/4W 470; VENDOR#: YAGEO#RC1206FR-07470RL
R7 = omcResistor:R1206: YAGEO RC1206 - General Purpose Chip Resistors Power dissipation: 0.250W 5% Tolerance E96 Series Operating Temperature Range: –55°C to +155°C Maximum Working Voltage: 200V Maximum Overload Voltage: 400V Temperature Coefficient: 10Ω< R≤10MΩ: ±100 ppm/°C R≤10Ω || R>10 MΩ: ±200 ppm/°C Jumper Criteria Rated Current: 2A Maximum Current: 10A Yageo Datasheet <http://www.yageo.ru/pdf/RC1206.pdf> Reichelt Datasheet <http://cdn-reichelt.de/documents/datenblatt/A900/SMD_1206.pdf>; DIST#REICHELT#: RND 1206 0; PMAX: 125mW
R8 = omcResistor:R1206: YAGEO RC1206 - General Purpose Chip Resistors Power dissipation: 0.250W 5% Tolerance E96 Series Operating Temperature Range: –55°C to +155°C Maximum Working Voltage: 200V Maximum Overload Voltage: 400V Temperature Coefficient: 10Ω< R≤10MΩ: ±100 ppm/°C R≤10Ω || R>10 MΩ: ±200 ppm/°C Jumper Criteria Rated Current: 2A Maximum Current: 10A Yageo Datasheet <http://www.yageo.ru/pdf/RC1206.pdf> Reichelt Datasheet <http://cdn-reichelt.de/documents/datenblatt/A900/SMD_1206.pdf>; DIST#REICHELT#: RND 1 1,6K; PMAX: 125mW
R9 R44 R47 R48 = omcResistor:R1206: YAGEO RC1206 - General Purpose Chip Resistors Power dissipation: 0.250W 5% Tolerance E96 Series Operating Temperature Range: –55°C to +155°C Maximum Working Voltage: 200V Maximum Overload Voltage: 400V Temperature Coefficient: 10Ω< R≤10MΩ: ±100 ppm/°C R≤10Ω || R>10 MΩ: ±200 ppm/°C Jumper Criteria Rated Current: 2A Maximum Current: 10A Yageo Datasheet <http://www.yageo.ru/pdf/RC1206.pdf> Reichelt Datasheet <http://cdn-reichelt.de/documents/datenblatt/A900/SMD_1206.pdf>; DIST#REICHELT#: RND 1 47K; PMAX: 125mW
R10 R31 = omcResistor:R1206: YAGEO RC1206 - General Purpose Chip Resistors Power dissipation: 0.250W 5% Tolerance E96 Series Operating Temperature Range: –55°C to +155°C Maximum Working Voltage: 200V Maximum Overload Voltage: 400V Temperature Coefficient: 10Ω< R≤10MΩ: ±100 ppm/°C R≤10Ω || R>10 MΩ: ±200 ppm/°C Jumper Criteria Rated Current: 2A Maximum Current: 10A Yageo Datasheet <http://www.yageo.ru/pdf/RC1206.pdf> Reichelt Datasheet <http://cdn-reichelt.de/documents/datenblatt/A900/SMD_1206.pdf>; DIST#REICHELT#: RND 1 110K; PMAX: 125mW
R11 R16 = omcResistor:R1206: YAGEO RC1206 - General Purpose Chip Resistors Power dissipation: 0.250W 5% Tolerance E96 Series Operating Temperature Range: –55°C to +155°C Maximum Working Voltage: 200V Maximum Overload Voltage: 400V Temperature Coefficient: 10Ω< R≤10MΩ: ±100 ppm/°C R≤10Ω || R>10 MΩ: ±200 ppm/°C Jumper Criteria Rated Current: 2A Maximum Current: 10A Yageo Datasheet <http://www.yageo.ru/pdf/RC1206.pdf> Reichelt Datasheet <http://cdn-reichelt.de/documents/datenblatt/A900/SMD_1206.pdf>; DIST#REICHELT#: RND 1 33K; PMAX: 125mW
R12 R20 = omcResistor:R1206: YAGEO RC1206 - General Purpose Chip Resistors Power dissipation: 0.250W 5% Tolerance E96 Series Operating Temperature Range: –55°C to +155°C Maximum Working Voltage: 200V Maximum Overload Voltage: 400V Temperature Coefficient: 10Ω< R≤10MΩ: ±100 ppm/°C R≤10Ω || R>10 MΩ: ±200 ppm/°C Jumper Criteria Rated Current: 2A Maximum Current: 10A Yageo Datasheet <http://www.yageo.ru/pdf/RC1206.pdf> Reichelt Datasheet <http://cdn-reichelt.de/documents/datenblatt/A900/SMD_1206.pdf>; DIST#REICHELT#: RND 1 2,2K; PMAX: 125mW
R13 = omcResistor:R1206: YAGEO RC1206 - General Purpose Chip Resistors Power dissipation: 0.250W 5% Tolerance E96 Series Operating Temperature Range: –55°C to +155°C Maximum Working Voltage: 200V Maximum Overload Voltage: 400V Temperature Coefficient: 10Ω< R≤10MΩ: ±100 ppm/°C R≤10Ω || R>10 MΩ: ±200 ppm/°C Jumper Criteria Rated Current: 2A Maximum Current: 10A Yageo Datasheet <http://www.yageo.ru/pdf/RC1206.pdf> Reichelt Datasheet <http://cdn-reichelt.de/documents/datenblatt/A900/SMD_1206.pdf>; DIST#REICHELT#: RND 1 9,1K; PMAX: 125mW
R15 = omcResistor:R1206: YAGEO RC1206 - General Purpose Chip Resistors Power dissipation: 0.250W 5% Tolerance E96 Series Operating Temperature Range: –55°C to +155°C Maximum Working Voltage: 200V Maximum Overload Voltage: 400V Temperature Coefficient: 10Ω< R≤10MΩ: ±100 ppm/°C R≤10Ω || R>10 MΩ: ±200 ppm/°C Jumper Criteria Rated Current: 2A Maximum Current: 10A Yageo Datasheet <http://www.yageo.ru/pdf/RC1206.pdf> Reichelt Datasheet <http://cdn-reichelt.de/documents/datenblatt/A900/SMD_1206.pdf>; DIST#REICHELT#: RND 1 100K; PMAX: 125mW
R17 = omcResistor:R1206: YAGEO RC1206 - General Purpose Chip Resistors Power dissipation: 0.250W 5% Tolerance E96 Series Operating Temperature Range: –55°C to +155°C Maximum Working Voltage: 200V Maximum Overload Voltage: 400V Temperature Coefficient: 10Ω< R≤10MΩ: ±100 ppm/°C R≤10Ω || R>10 MΩ: ±200 ppm/°C Jumper Criteria Rated Current: 2A Maximum Current: 10A Yageo Datasheet <http://www.yageo.ru/pdf/RC1206.pdf> Reichelt Datasheet <http://cdn-reichelt.de/documents/datenblatt/A900/SMD_1206.pdf>; DIST#REICHELT#: RND 1 11K; PMAX: 125mW
R18 R19 R42 R43 R45 R46 = omcResistor:R1206: YAGEO RC1206 - General Purpose Chip Resistors Power dissipation: 0.250W 5% Tolerance E96 Series Operating Temperature Range: –55°C to +155°C Maximum Working Voltage: 200V Maximum Overload Voltage: 400V Temperature Coefficient: 10Ω< R≤10MΩ: ±100 ppm/°C R≤10Ω || R>10 MΩ: ±200 ppm/°C Jumper Criteria Rated Current: 2A Maximum Current: 10A Yageo Datasheet <http://www.yageo.ru/pdf/RC1206.pdf> Reichelt Datasheet <http://cdn-reichelt.de/documents/datenblatt/A900/SMD_1206.pdf>; DIST#REICHELT#: RND 1 1,0K; PMAX: 125mW
R21 = omcResistor:R1206: YAGEO RC1206 - General Purpose Chip Resistors Power dissipation: 0.250W 5% Tolerance E96 Series Operating Temperature Range: –55°C to +155°C Maximum Working Voltage: 200V Maximum Overload Voltage: 400V Temperature Coefficient: 10Ω< R≤10MΩ: ±100 ppm/°C R≤10Ω || R>10 MΩ: ±200 ppm/°C Jumper Criteria Rated Current: 2A Maximum Current: 10A Yageo Datasheet <http://www.yageo.ru/pdf/RC1206.pdf> Reichelt Datasheet <http://cdn-reichelt.de/documents/datenblatt/A900/SMD_1206.pdf>; DIST#REICHELT#: RND 1 12K; PMAX: 125mW
R22 = omcResistor:R1206: YAGEO RC1206 - General Purpose Chip Resistors Power dissipation: 0.250W 5% Tolerance E96 Series Operating Temperature Range: –55°C to +155°C Maximum Working Voltage: 200V Maximum Overload Voltage: 400V Temperature Coefficient: 10Ω< R≤10MΩ: ±100 ppm/°C R≤10Ω || R>10 MΩ: ±200 ppm/°C Jumper Criteria Rated Current: 2A Maximum Current: 10A Yageo Datasheet <http://www.yageo.ru/pdf/RC1206.pdf> Reichelt Datasheet <http://cdn-reichelt.de/documents/datenblatt/A900/SMD_1206.pdf>; DIST#REICHELT#: RND 1 36K; PMAX: 125mW
R23 = omcResistor:R1206: YAGEO RC1206 - General Purpose Chip Resistors Power dissipation: 0.250W 5% Tolerance E96 Series Operating Temperature Range: –55°C to +155°C Maximum Working Voltage: 200V Maximum Overload Voltage: 400V Temperature Coefficient: 10Ω< R≤10MΩ: ±100 ppm/°C R≤10Ω || R>10 MΩ: ±200 ppm/°C Jumper Criteria Rated Current: 2A Maximum Current: 10A Yageo Datasheet <http://www.yageo.ru/pdf/RC1206.pdf> Reichelt Datasheet <http://cdn-reichelt.de/documents/datenblatt/A900/SMD_1206.pdf>; DIST#REICHELT#: RND 1 390K; PMAX: 125mW
R24 = omcResistor:R1206: YAGEO RC1206 - General Purpose Chip Resistors Power dissipation: 0.250W 5% Tolerance E96 Series Operating Temperature Range: –55°C to +155°C Maximum Working Voltage: 200V Maximum Overload Voltage: 400V Temperature Coefficient: 10Ω< R≤10MΩ: ±100 ppm/°C R≤10Ω || R>10 MΩ: ±200 ppm/°C Jumper Criteria Rated Current: 2A Maximum Current: 10A Yageo Datasheet <http://www.yageo.ru/pdf/RC1206.pdf> Reichelt Datasheet <http://cdn-reichelt.de/documents/datenblatt/A900/SMD_1206.pdf>; DIST#REICHELT#: RND 1 62K; PMAX: 125mW
R25 = omcResistor:R1206: YAGEO RC1206 - General Purpose Chip Resistors Power dissipation: 0.250W 5% Tolerance E96 Series Operating Temperature Range: –55°C to +155°C Maximum Working Voltage: 200V Maximum Overload Voltage: 400V Temperature Coefficient: 10Ω< R≤10MΩ: ±100 ppm/°C R≤10Ω || R>10 MΩ: ±200 ppm/°C Jumper Criteria Rated Current: 2A Maximum Current: 10A Yageo Datasheet <http://www.yageo.ru/pdf/RC1206.pdf> Reichelt Datasheet <http://cdn-reichelt.de/documents/datenblatt/A900/SMD_1206.pdf>; DIST#REICHELT#: RND 1 1M; PMAX: 125mW
R26 = omcResistor:R1206: YAGEO RC1206 - General Purpose Chip Resistors Power dissipation: 0.250W 5% Tolerance E96 Series Operating Temperature Range: –55°C to +155°C Maximum Working Voltage: 200V Maximum Overload Voltage: 400V Temperature Coefficient: 10Ω< R≤10MΩ: ±100 ppm/°C R≤10Ω || R>10 MΩ: ±200 ppm/°C Jumper Criteria Rated Current: 2A Maximum Current: 10A Yageo Datasheet <http://www.yageo.ru/pdf/RC1206.pdf> Reichelt Datasheet <http://cdn-reichelt.de/documents/datenblatt/A900/SMD_1206.pdf>; DIST#CONRAD#: 1473270 - 62; PMAX: 500mW; VENDOR#: Panasonic, ERJ-8BQJR27V
R29 = omcResistor:R1206: YAGEO RC1206 - General Purpose Chip Resistors Power dissipation: 0.250W 5% Tolerance E96 Series Operating Temperature Range: –55°C to +155°C Maximum Working Voltage: 200V Maximum Overload Voltage: 400V Temperature Coefficient: 10Ω< R≤10MΩ: ±100 ppm/°C R≤10Ω || R>10 MΩ: ±200 ppm/°C Jumper Criteria Rated Current: 2A Maximum Current: 10A Yageo Datasheet <http://www.yageo.ru/pdf/RC1206.pdf> Reichelt Datasheet <http://cdn-reichelt.de/documents/datenblatt/A900/SMD_1206.pdf>; DIST#REICHELT#: RND 1 1,8K; PMAX: 125mW
R32 = omcResistor:R1206: YAGEO RC1206 - General Purpose Chip Resistors Power dissipation: 0.250W 5% Tolerance E96 Series Operating Temperature Range: –55°C to +155°C Maximum Working Voltage: 200V Maximum Overload Voltage: 400V Temperature Coefficient: 10Ω< R≤10MΩ: ±100 ppm/°C R≤10Ω || R>10 MΩ: ±200 ppm/°C Jumper Criteria Rated Current: 2A Maximum Current: 10A Yageo Datasheet <http://www.yageo.ru/pdf/RC1206.pdf> Reichelt Datasheet <http://cdn-reichelt.de/documents/datenblatt/A900/SMD_1206.pdf>; DIST#CONRAD#: 1479236 - 62; PMAX: 125mW; VENDOR#: Panasonic, ERJ-8RQFR22V
R33 = omcResistor:R1206: YAGEO RC1206 - General Purpose Chip Resistors Power dissipation: 0.250W 5% Tolerance E96 Series Operating Temperature Range: –55°C to +155°C Maximum Working Voltage: 200V Maximum Overload Voltage: 400V Temperature Coefficient: 10Ω< R≤10MΩ: ±100 ppm/°C R≤10Ω || R>10 MΩ: ±200 ppm/°C Jumper Criteria Rated Current: 2A Maximum Current: 10A Yageo Datasheet <http://www.yageo.ru/pdf/RC1206.pdf> Reichelt Datasheet <http://cdn-reichelt.de/documents/datenblatt/A900/SMD_1206.pdf>; DIST#REICHELT#: RND 1 910; PMAX: 125mW
R34 R50 = omcResistor:R1206: YAGEO RC1206 - General Purpose Chip Resistors Power dissipation: 0.250W 5% Tolerance E96 Series Operating Temperature Range: –55°C to +155°C Maximum Working Voltage: 200V Maximum Overload Voltage: 400V Temperature Coefficient: 10Ω< R≤10MΩ: ±100 ppm/°C R≤10Ω || R>10 MΩ: ±200 ppm/°C Jumper Criteria Rated Current: 2A Maximum Current: 10A Yageo Datasheet <http://www.yageo.ru/pdf/RC1206.pdf> Reichelt Datasheet <http://cdn-reichelt.de/documents/datenblatt/A900/SMD_1206.pdf>; DIST#REICHELT#: RND 1 3,9K; PMAX: 125mW
R35 R49 = omcResistor:R1206: YAGEO RC1206 - General Purpose Chip Resistors Power dissipation: 0.250W 5% Tolerance E96 Series Operating Temperature Range: –55°C to +155°C Maximum Working Voltage: 200V Maximum Overload Voltage: 400V Temperature Coefficient: 10Ω< R≤10MΩ: ±100 ppm/°C R≤10Ω || R>10 MΩ: ±200 ppm/°C Jumper Criteria Rated Current: 2A Maximum Current: 10A Yageo Datasheet <http://www.yageo.ru/pdf/RC1206.pdf> Reichelt Datasheet <http://cdn-reichelt.de/documents/datenblatt/A900/SMD_1206.pdf>; DIST#REICHELT#: RND 1 15K; PMAX: 125mW
REF1 = omcReferences:LM4040: LM4040 - Precision Micropower Shunt Voltage Reference Features: 2.5V/SOT-23 AEC Q-100 Grades 1 and 3 available Small packages: SOT-23, TO-92 and SC70 No output capacitor required Tolerates capacitive loads Fixed reverse breakdown voltages of 2.048V, 2.500V, 3.000V, 4.096V, 5.000V, 8.192V, and 10.000V Key Specifications: Output voltage tolerance: ±0.1% (max) Low output noise (10Hz to 10kHz): 35 μVrms(typ) Wide operating current range: 60 μA to 15 mA Industrial temperature range: −40°C to +85°C Low temperature coefficient: 100 ppm/°C (max) Datasheets: Texas Instruments <http://www.ti.com/lit/ds/symlink/lm4040-n.pdf> Reichelt <https://cdn-reichelt.de/documents/datenblatt/A200/LM4040-TI.pdf>; DIST#REICHELT#: LM 4040 BIM3-4.1; VALUE: LM4040-4.1V; VENDOR#: TI, LM4040BIM3-4.1/NOPB
T1 = omcTransistor:BC847: BC847 - NPN general purpose transistors VCEO=45V IC=100mA Complementary Type: BC847 Infineon Datasheet <https://www.infineon.com/dgdl/Infineon-BC847SERIES_BC848SERIES_BC849SERIES_BC850SERIES-DS-v01_01-en.pdf?fileId=db3a304314dca389011541d4630a1657> Reichelt Datasheet <http://cdn-reichelt.de/documents/datenblatt/A100/BC846-848-CDIL.pdf> Ratings Symbol Parameter Conditions Min. Typ. Max. Unit hFE DC Current Gain BC847A Ic=2mA Vce=5V 110 180 220 BC847B 200 290 450 BC847C 420 520 800 VBE Base-emitter-volatge Ic=2mA Vce=5V 580 660 700 mV Ptot Total Power dissipation Tamb ≤ 25 °C 250 mW Tamb operating ambient temperature -65 150 °C; DIST#REICHELT#: BC 847A SMD
T2 = omcTransistor:IRL530: IRL530NS/L - HEXFET® Power MOSFET VDSS=55V RDS,on=0.12Ω @ VGS = 5.0V ID=17A Datasheet: IRF <http://www.irf.com/product-info/datasheets/data/irl530ns.pdf> Reichelt <https://cdn-reichelt.de/documents/datenblatt/A100/IRL530NS_IR.pdf>; DIST#REICHELT#: IRL 530NS; VENDOR#: IRF, IRL530NS
T3 T4 = omcTransistor:BSS138: BSS 138 - N-Channel Logic Level Enhancement Mode Field Effect Transistor VDSS=50V VGS=±20V RDS,on=3.5Ω Drain currunt: 200mA continous 800mA pulsed PD=225mW On Semiconductor Datasheet <http://www.onsemi.com/pub_link/Collateral/BSS138LT1-D.PDF> Reichelt Datasheet <http://cdn-reichelt.de/documents/datenblatt/A200/BSS138-FSC.pdf>; #VENDOR: ON_SEMICONDUCTOR,BSS138L; DIST#REICHELT#: BSS 138 SMD
X2 = omcConnector:BOXHD-06: Box Header 2X3 Mechanical Terminals: 6 Rows: 2 Operating Temperature: -55°C...+105°C Electrical Imax: 3A RInsulation,min: 1000MΩ Rcontact,max: 20mΩ VAC: 550V; DIST#REICHELT#: WSL 6G
X3 = omcConnector:MAB: PCB DIN 5 Pin Socket Current Rating: 1A Dielectric Strength: AC 1000V/MIN. R.M.S. Insulator Resistance: 5000MΩ MIN. AT 500V DC Contact Resistance: 8mΩ MAX Operation Temperature: -55°C TO +105°C Datasheet: Reichelt <https://cdn-reichelt.de/documents/datenblatt/C160/DS_MAPBMS5.pdf>; DIST#REICHELT: MABPM 5S

## Board
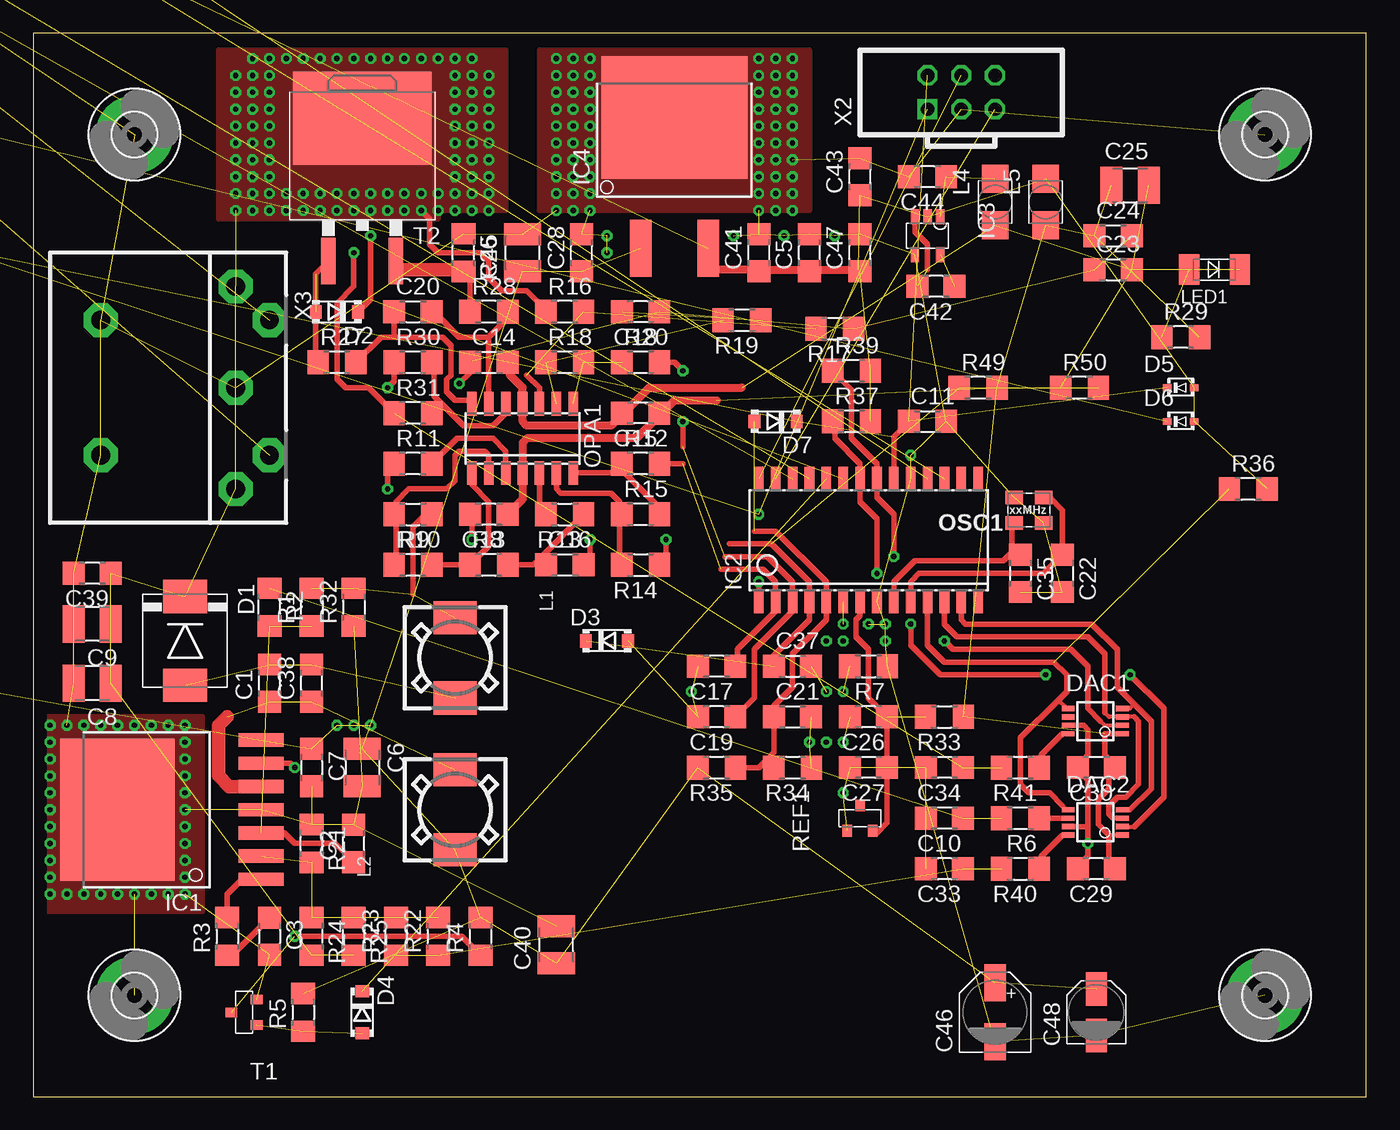
[diagram p2: board, top side]
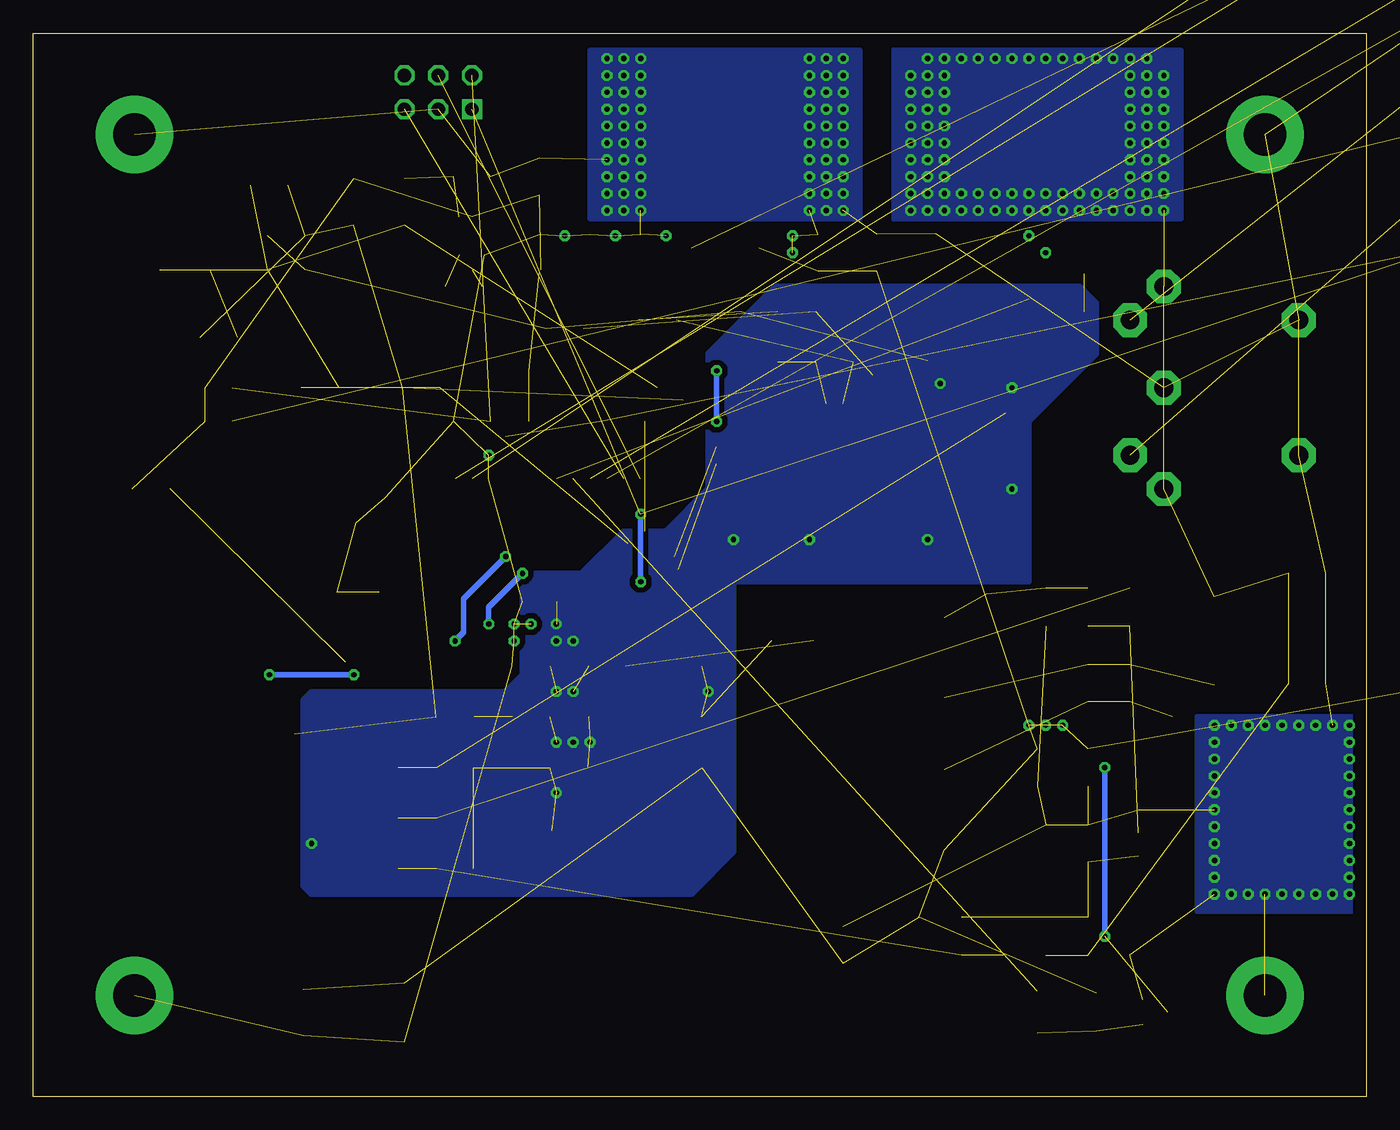
[diagram p3: board, bottom side, seen from below]

Size 100.33 x 80.01 mm. Coordinates in mm from the lower left corner, seen from the top.
Outline: 0,0 100.33,0 100.33,80.01 0,80.01 0,0
Copper layers (1*16): Top 0.035mm / dielectric 1.5mm / Bottom 0.035mm
Design rules "default": minimum track width 10mil, minimum drill 24mil, track to track 8mil, track to pad 8mil, pad to pad 8mil, via to via 8mil, smd to smd 8mil, copper to edge 40mil, drill to drill 8mil, minimum pad ring 10mil, minimum via ring 8mil, stop-mask expansion 4mil, vias tented up to drill 0mil, thermal gap 10mil

### Footprints (pad centres in the part's own frame; a part is rotated, then mirrored left to right if it is on the bottom)
1206 = smd 1.651 x 1.727: 1 -1.4,0; 2 1.4,0
1210 = smd 1.651 x 2.794: 1 -1.4,0; 2 1.4,0
PANC = smd 1.6 x 2.8: CN 0,-2.223; CP 0,2.223
PANB = smd 1.6 x 2.5: CN 0,-1.746; CP 0,1.746
DO214AB = smd 2.5 x 3.3: A 3.334,0; C -3.334,0
SOD123 = smd 0.889 x 1.016: A 1.587,0; C -1.587,0
SOD323 = smd 0.635 x 0.508: A 1.016,0; C -1.016,0
MSOP8 = smd 0.4 x 0.95: 1 0.635,0.575; 2 1.27,0.575; 3 1.905,0.575; 4 2.54,0.575; 5 2.54,4.664; 6 1.905,4.664; 7 1.27,4.664; 8 0.635,4.664
OMT125 = smd 3 x 2.8: 1 -3.175,0; 2 3.175,0
3,2-PAD = drill 3.2 pad 5.842: B3,2 0,0
TO263-7 = smd 1 x 3.4: 1 -5.239,-8.255; 2 -3.493,-8.255; 3 -1.746,-8.255; 4 0,-8.255; 5 1.746,-8.255; 6 3.493,-8.255; 7 5.239,-8.255 | smd 10.7 x 8.6: 8 0,2.54
SOIC28-7.62 = smd 0.72 x 1.78: 1 -8.255,-5.299; 2 -6.985,-5.299; 3 -5.715,-5.299; 4 -4.445,-5.299; 5 -3.175,-5.299; 6 -1.905,-5.299; 7 -0.635,-5.299; 8 0.635,-5.299; 9 1.905,-5.299; 10 3.175,-5.299; 11 4.445,-5.299; 12 5.715,-5.299; 13 6.985,-5.299; 14 8.255,-5.299; 15 8.255,3.949; 16 6.985,3.949; 17 5.715,3.949; 18 4.445,3.949; 19 3.175,3.949; 20 1.905,3.949; 21 0.635,3.949; 22 -0.635,3.949; 23 -1.905,3.949; 24 -3.175,3.949; 25 -4.445,3.949; 26 -5.715,3.949; 27 -6.985,3.949; 28 -8.255,3.949
SOT23-5 = smd 0.635 x 1.143: 1 -0.953,-1.429; 2 0,-1.429; 3 0.953,-1.429; 4 0.953,1.429; 5 -0.953,1.429
TO263 = smd 1.6 x 4.293: 1 -2.54,-6.032; 3 2.54,-6.032 | smd 11 x 9.2: 4 0,3.81
1X04 = drill 1.016 long: 1 -3.81,0; 2 -1.27,0; 3 1.27,0; 4 3.81,0
DR74 = smd 2.5 x 3.25: 1 2.064,4.445; 2 8.096,4.445
1210' = smd 2.1 x 2: 1 -1.746,0; 2 1.746,0
LED3216 = smd 1.524 x 2.286: 1 -1.905,0; 2 1.905,0
SOIC14 = smd 0.72 x 1.78: 1 0.635,1.21; 2 1.905,1.21; 3 3.175,1.21; 4 4.445,1.21; 5 5.715,1.21; 6 6.985,1.21; 7 8.255,1.21; 8 8.255,6.41; 9 6.985,6.41; 10 5.715,6.41; 11 4.445,6.41; 12 3.175,6.41; 13 1.905,6.41; 14 0.635,6.41
MT = smd 1.321 x 1.016: 1 -1.111,-0.953; 2 1.111,-0.953; 3 1.111,0.953; 4 -1.111,0.953
1206' = smd 1.6 x 1.803: 1 -1.422,0; 2 1.422,0
SOT23 = smd 0.711 x 0.889: 1 -0.953,-0.953; 2 0.953,-0.953; 3 0,0.953
TO263AB = smd 1.1 x 3.5: 1 3.175,1.905; 3 8.255,1.905 | smd 10.41 x 7.01: 4 5.715,12.66
BOXHD-06-2.54-S = drill 1 square: 1 -1.27,2.54 | drill 1 octagon: 2 1.27,2.54; 3 -1.27,0; 4 1.27,0; 5 -1.27,-2.54; 6 1.27,-2.54
DIN5P = drill 1.4 pad 2.54 octagon: 1 17.78,3.81; 2 10.16,3.81; 3 2.54,3.81; 4 15.24,1.27; 5 5.08,1.27; S1 5.08,13.97; S2 15.24,13.97

### Placement (x,y rotation side)
C1  17.78,31.11 90 top
C2  24.13,19.05 90 top
C3  17.78,12.06 270 top
C4  -83.82,54.61 0 top  (outside the outline)
C5  58.42,63.5 90 top
C6  24.77,24.77 270 top
C7  20.95,24.77 270 top
C8  4.45,31.11 180 top
C9  4.45,35.56 180 top
C10  68.58,20.95 180 top
C11  67.31,50.8 0 top
C12  -95.25,82.55 0 top  (outside the outline)
C13  34.29,43.81 180 top
C14  34.29,55.24 0 top
C15  45.72,51.44 180 top
C16  40.01,40.01 0 top
C17  51.44,32.38 180 top
C18  45.72,59.05 180 top
C19  51.44,28.57 180 top
C20  28.57,59.05 0 top
C21  57.15,28.57 0 top
C22  77.47,39.37 270 top
C23  81.28,62.23 0 top
C24  81.28,64.77 0 top
C25  82.55,68.58 0 top
C26  62.87,28.57 180 top
C27  62.87,24.77 180 top
C28  41.27,63.5 90 top
C29  80.01,17.14 180 top
C30  80.01,24.77 180 top
C33  68.58,17.14 180 top
C34  68.58,24.77 180 top
C35  74.3,39.37 270 top
C36  -63.5,76.2 0 top  (outside the outline)
C37  57.15,32.38 0 top
C38  20.95,31.11 90 top
C39  4.45,39.37 180 top
C40  39.37,11.43 90 top
C41  54.61,63.5 90 top
C42  67.94,60.96 180 top
C43  62.23,69.22 90 top
C44  67.31,69.22 180 top
C45  36.83,63.5 90 top
C46  72.39,6.35 0 top
C47  62.23,63.5 90 top
C48  80.01,6.35 0 top
D1  11.43,34.29 270 top
D2  22.86,59.05 180 top
D3  43.18,34.29 0 top
D4  24.77,6.35 270 top
D5  86.36,53.34 0 top
D6  86.36,50.8 0 top
D7  55.88,50.8 180 top
DAC1  82.55,26.67 90 top
DAC2  82.55,19.05 90 top
F1  -83.82,44.45 0 top  (outside the outline)
H1  92.71,72.39 0 top
H2  7.62,72.39 0 top
H3  92.71,7.62 0 top
H4  7.62,7.62 0 top
IC1  8.89,21.59 90 top
IC2  62.87,42.55 0 top
IC3  67.31,64.77 180 top
IC4  48.26,69.85 0 top
JP1  -46.99,106.68 0 top  (outside the outline)
L1  27.3,38.1 270 top
L2  36.2,16.51 90 top
L4  100µ  [1210']  72.39,67.31 270 top
L5  100µ  [1210']  76.2,67.31 270 top
LED1  88.9,62.23 0 top
OPA1  32.38,45.72 0 top
OSC1  74.93,44.13 180 top
R1  10K  [1206']  20.95,36.83 90 top
R2  240K  [1206']  17.78,36.83 270 top
R3  270R  [1206']  14.61,12.06 90 top
R4  10K  [1206']  33.66,12.06 90 top
R5  10K  [1206']  20.32,6.35 90 top
R6  470R  [1206']  74.3,20.95 180 top
R7  0R  [1206']  62.87,32.38 180 top
R8  1K6  [1206']  34.29,40.01 0 top
R9  47K  [1206']  28.57,43.81 180 top
R10  110K  [1206']  28.57,40.01 0 top
R11  33K  [1206']  28.57,47.62 0 top
R12  2K2  [1206']  45.72,47.62 0 top
R13  9K1  [1206']  40.01,43.81 180 top
R14  10K  [1206']  45.72,40.01 180 top
R15  100K  [1206']  45.72,43.81 0 top
R16  33K  [1206']  40.01,59.05 0 top
R17  11K  [1206']  60.33,57.78 180 top
R18  1K  [1206']  40.01,55.24 0 top
R19  1K  [1206']  53.34,58.42 180 top
R20  2K2  [1206']  45.72,55.24 0 top
R21  12K  [1206']  20.95,19.05 270 top
R22  36K  [1206']  30.48,12.06 90 top
R23  390K  [1206']  27.3,12.06 90 top
R24  62K  [1206']  20.95,12.06 270 top
R25  1M  [1206']  24.13,12.06 270 top
R26  0R27  [1206']  32.38,63.5 270 top
R27  10K  [1206']  22.86,55.24 0 top
R28  10K  [1206']  34.29,59.05 0 top
R29  1K8  [1206']  86.36,57.15 0 top
R30  10K  [1206']  28.57,55.24 0 top
R31  110K  [1206']  28.57,51.44 0 top
R32  0R22  [1206']  24.13,36.83 90 top
R33  910R  [1206']  68.58,28.57 180 top
R34  3K9  [1206']  57.15,24.77 180 top
R35  15K  [1206']  51.44,24.77 180 top
R36  10K  [1206']  91.44,45.72 0 top
R37  10K  [1206']  61.59,50.8 0 top
R38  10K  [1206']  -99.06,95.25 0 top  (outside the outline)
R39  10K  [1206']  61.59,54.61 0 top
R40  470R  [1206']  74.3,17.14 180 top
R41  470R  [1206']  74.3,24.77 180 top
R42  1K  [1206']  -16.51,101.6 0 top  (outside the outline)
R43  1K  [1206']  -22.86,101.6 0 top  (outside the outline)
R44  47K  [1206']  -29.21,101.6 0 top  (outside the outline)
R45  1K  [1206']  -35.56,101.6 0 top  (outside the outline)
R46  1K  [1206']  -41.91,101.6 0 top  (outside the outline)
R47  47K  [1206']  -48.26,101.6 0 top  (outside the outline)
R48  47K  [1206']  -54.61,101.6 0 top  (outside the outline)
R49  15K  [1206']  71.12,53.34 0 top
R50  3K9  [1206']  78.74,53.34 0 top
REF1  62.23,20.95 0 top
T1  15.88,6.35 90 top
T2  19.05,60.96 0 top
T3  -99.06,43.18 0 top  (outside the outline)
T4  -15.24,54.61 0 top  (outside the outline)
X2  69.85,75.56 90 top
X3  19.05,43.18 90 top

### Tracks (layer width: path | path; a pad name or v marks a point on that pad's centre or on a via)
!CS_DAC1  (via drill 0.4 pad 0.81)
  Top 0.305: 80.33,28.26 80.64,27.94 DAC1.2
  Top 0.406: R39.1 61.59,53.19 61.59,49.53 63.5,47.62 IC2.21 63.5,45.09 64.77,43.81 v64.77,40.64 | v68.58,34.29 69.22,33.66 78.11,33.66 79.38,32.38 79.38,29.21 80.33,28.26
  Bottom 0.406: v64.77,40.64 67.94,37.47 67.94,34.92 v68.58,34.29
!CS_DAC2  (via drill 0.4 pad 0.81)
  Top 0.305: DAC2.2 82.87,20.32
  Top 0.406: R37.1 60.33,50.65 60.33,49.53 62.23,47.62 IC2.22 62.23,44.77 63.5,43.5 v63.5,39.37 | 82.87,20.32 85.09,22.54 85.09,29.21 v82.55,31.75 | v66.04,35.56 66.04,33.97 68.26,31.75 v76.2,31.75
  Bottom 0.406: v66.04,35.56 66.04,36.83 v63.5,39.37 | v76.2,31.75 v82.55,31.75
!MCLR  (via drill 0.4 pad 0.81)  (2 unrouted)
  Top 0.406: IC2.1 v54.61,38.73
  Bottom 0.406: v54.61,38.73 v54.61,43.81
+3V3  (5 unrouted)
+5V  (7 unrouted)
  Top 0.305: DAC2.1 80.96,19.68
  Top 0.406: 81.41,17.65 C29.1 80.96,17.59 80.96,19.68 80.17,20.48 80.17,22.38 80.96,23.18 80.96,24.77 | 80.96,24.77 80.96,25.4 80.64,25.72 80.64,27.3 DAC1.1 | C30.1 80.96,24.77
  Top 0.61: 51.44,52.39 48.26,52.39 47.15,51.28 | 47.15,51.28 45.4,49.53 37.15,49.53 36.83,49.21 OPA1.4 36.83,44.95 C13.1 | C15.1 47.12,51.3 47.15,51.28
+12V  (via drill 0.4 pad 0.81)  (17 unrouted)
  other vias: 22.86,27.94 24.13,27.94 25.4,27.94
-5V  (5 unrouted)
  Top 0.406: C15.2 44.45,51.44
  Top 0.61: 53.34,53.34 46.35,53.34 44.32,51.3 | 44.32,51.3 43.5,50.48 37.15,50.48 36.83,50.8 OPA1.11 36.83,53.34 35.88,54.29 35.88,55.06 C14.2 | C15.2 44.32,51.3
EN_XCHRG  (via drill 0.4 pad 0.81)  (1 unrouted)
  Top 0.406: v25.4,64.77 25.4,60.01 D2.C
GND  (via drill 0.4 pad 0.81)  (53 unrouted)
  other vias: 10.16,15.24 8.89,15.24 7.62,15.24 6.35,15.24 5.08,15.24 3.81,15.24 2.54,15.24 1.27,15.24 1.27,16.51 1.27,17.78 1.27,19.05 1.27,20.32 1.27,21.59 1.27,22.86 1.27,24.13 1.27,25.4 1.27,26.67 1.27,27.94 2.54,27.94 3.81,27.94 5.08,27.94 6.35,27.94 7.62,27.94 8.89,27.94 10.16,27.94 11.43,15.24 11.43,16.51 11.43,17.78 11.43,19.05 11.43,20.32 11.43,21.59 11.43,22.86 11.43,24.13 11.43,25.4 11.43,26.67 11.43,27.94 39.37,78.11 39.37,76.83 39.37,75.56 39.37,74.3 39.37,73.03 39.37,71.75 39.37,70.48 39.37,69.22 39.37,67.94 39.37,66.67 40.64,78.11 40.64,76.83 40.64,75.56 40.64,74.3 40.64,73.03 40.64,71.75 40.64,70.48 40.64,69.22 40.64,67.94 40.64,66.67 41.91,78.11 41.91,76.83 41.91,75.56 41.91,74.3 41.91,73.03 41.91,71.75 41.91,70.48 41.91,69.22 41.91,67.94 41.91,66.67 54.61,78.11 55.88,78.11 57.15,78.11 54.61,76.83 54.61,75.56 54.61,74.3 54.61,73.03 54.61,71.75 54.61,70.48 54.61,69.22 54.61,67.94 54.61,66.67 55.88,66.67 55.88,67.94 55.88,69.22 55.88,70.48 55.88,71.75 55.88,73.03 55.88,74.3 55.88,75.56 55.88,76.83 57.15,76.83 57.15,75.56 57.15,74.3 57.15,73.03 57.15,71.75 57.15,70.48 57.15,69.22 57.15,67.94 57.15,66.67 43.18,63.5 43.18,64.77 52.7,64.77 56.52,64.77 60.33,64.77 64.14,35.56 64.14,34.29 66.04,48.26 62.87,35.56
  pour Top (isolate 0.305, no thermals): 0.64,13.97 12.7,13.97 12.7,28.57 0.64,28.57
  pour Bottom (isolate 0.305, no thermals): 12.7,13.97 0.64,13.97 0.64,28.57 12.7,28.57
  pour Bottom (isolate 0.406, no thermals): 38.1,66.04 58.42,66.04 58.42,78.74 38.1,78.74
  pour Top (isolate 0.406, no thermals): 58.42,66.67 38.1,66.67 38.1,78.74 58.42,78.74
GNDA  (via drill 0.4 pad 0.81)  (18 unrouted)
  Top 0.406: 33.02,55.38 C14.1 32.89,54.48 v32.07,53.66 | v33.02,41.91 33.02,43.69 C13.2 | v26.67,45.72 26.67,47.14 R11.1 | v41.91,41.91 41.91,40.51 C16.2 | v47.62,41.91 47.62,40.49 R14.1 | R30.1 27.15,53.82 v26.67,53.34 | C29.2 78.61,17.33 79.38,18.1 v79.38,19.05 79.38,20.32 | 79.06,24.77 79.06,24.13 79.38,23.81 79.38,20.32 | 79.06,24.77 79.06,25.4 79.38,25.72 79.38,27.62 79.06,27.94 DAC1.7 | C30.2 79.06,24.77 | DAC2.7 79.38,20.32
  other vias: 60.96,34.29 60.96,35.56 60.96,30.48 60.96,26.67 59.69,26.67 58.42,26.67 59.69,34.29 59.69,30.48 49.53,30.48 60.96,22.86
  pour Bottom (isolate 0.406, rank 2): 44.45,60.96 21.59,60.96 20.32,59.69 20.32,55.88 25.4,50.8 25.4,38.73 49.53,38.73 49.53,55.88
  pour Bottom (isolate 0.406, rank 2): 49.53,45.72 52.7,42.55 55.88,42.55 59.05,39.37 62.87,39.37 63.5,38.73 63.5,31.75 64.77,30.48 79.38,30.48 80.01,29.84 80.01,15.88 79.38,15.24 50.8,15.24 47.62,18.41 47.62,45.09 48.26,45.72
IM_CHG  (3 unrouted)
  Top 0.406: R9.1 29.53,43.81 28.57,42.86 28.57,37.78
IM_CHG_AD  (1 unrouted)
  Top 0.406: 51.75,39.69 54.93,39.69 55.88,38.73 IC2.2 55.88,36.51 53.02,33.66 53.02,32.57 C17.1 | 48.9,47.62 R12.2
  Top 0.61: C17.1 52.84,32.52
IS_CHG  (2 unrouted)
IS_XCHRG  (via drill 0.4 pad 0.81)  (2 unrouted)
  Top 0.406: 27.15,51.59 R31.1 25.25,53.34 23.5,53.34 22.86,53.98 22.86,59.69 24.13,60.96 v24.13,63.5
LED1  (1 unrouted)
LED2  (1 unrouted)
N$1  (3 unrouted)
N$2  (3 unrouted)
  Top 1.016: IC1.5 14.76,23.34 13.97,24.13 13.97,27.94 14.61,28.57
N$3
  Top 0.406: OPA1.3 35.56,48.58 34.61,49.53 31.9,49.53 R11.2
N$4  (2 unrouted)
N$5  (2 unrouted)
N$6
  Top 0.406: R3.1 14.96,10.64 C3.1
N$7
  Top 0.406: R3.2 14.61,15.24 15.88,16.51 16.99,16.51 IC1.1
N$8  (2 unrouted)
  Top 0.406: IC1.3 18.89,19.84 19.68,19.05 22.73,19.05 C2.1
N$9  (via drill 0.4 pad 0.81)  (1 unrouted)
  Top 0.406: IC1.6 19.37,25.08 v19.68,24.77 | v19.68,12.06 32.23,12.06 R4.1
  Bottom 0.406: v19.68,24.77 v19.68,12.06
N$10
  Top 0.305: DAC1.4 82.55,29.21 82.87,29.53
  Top 0.406: DAC2.4 82.55,21.59 84.14,23.18 84.14,28.26 82.87,29.53 81.6,30.8 81.6,33.66 79.69,35.56 70.17,35.56 69.85,35.88 IC2.13
N$11
  Top 0.406: OPA1.2 34.29,48.26 33.97,48.58 32.07,48.58 31.75,48.26 31.75,46.35 31.11,45.72 28.26,45.72 27.3,44.77 27.3,43.81 | 27.3,43.81 27.3,40.16 R10.1 | R9.2 27.3,43.81
N$12
  Top 0.406: OPA1.1 33.02,46.04 34.29,44.77 34.29,41.43 R8.1 R10.2
N$13
  Top 0.406: R8.2 37.62,40.01 38.02,40.41 | 38.02,40.41 R13.1 | C16.1 38.42,40.01 38.02,40.41
N$14
  Top 0.406: OPA1.5 38.1,44.3 R13.2
N$15
  Top 0.406: OPA1.6 39.37,45.72 39.69,45.4 43.5,45.4 44.13,44.77 44.13,43.81 | 44.13,43.81 44.13,40.17 R14.2 | R15.1 44.13,43.81
N$16  (2 unrouted)
  Top 0.406: OPA1.10 38.1,53.34 37.15,54.29
N$17
  Top 0.406: OPA1.7 44.13,46.93 | 44.13,46.93 44.51,46.93 46.99,44.45 46.99,43.97 R15.2 | R12.1 44.3,47.1 44.13,46.93
N$18  (2 unrouted)
N$19  (1 unrouted)
N$20
  Top 0.305: DAC2.3 81.28,20.95 | 82.87,28.57 DAC1.3 80.96,28.57 80.64,28.89
  Top 0.406: 81.28,20.95 80.96,21.27 80.96,21.91 81.6,22.54 82.23,22.54 83.19,23.5 83.19,28.26 82.87,28.57 | IC2.12 68.58,35.56 69.53,34.61 79.38,34.61 80.64,33.34 80.64,28.89
N$21
  Top 0.406: 33.02,52.39 OPA1.14 32.76,52.39 31.75,52.39 31.11,53.02 31.11,53.98 31.43,54.29 31.43,56.52 30.8,57.15 27.3,57.15 | 27.3,57.15 26.19,57.15 R27.2 | C20.1 27.18,57.28 27.3,57.15
N$22  (1 unrouted)
  Top 0.406: 66.36,66.36 IC3.3 66.36,65.09 67.31,64.14 67.31,62.23 | C42.2 66.04,60.96
N$23  (1 unrouted)
  Top 0.406: T2.1 21.27,61.91 21.27,55.41 R27.1
N$24
  Top 0.406: OPA1.12 35.56,51.44 34.61,50.48 32.38,50.48 30.8,52.07 | R31.2 30.16,51.44 30.8,52.07 | 30.8,52.07 30.16,52.7 30.16,55.08 R30.2
N$25
  Top 0.406: OPA1.13 34.29,57.15 | C20.2 30.16,59.05 32.07,57.15 34.29,57.15 | R28.2 35.71,58.57 34.29,57.15
N$26
  Top 0.406: 32.69,62.08 R26.2 32.87,61.59 R28.1
  Top 1.016: R26.2 32.23,62.23 27.3,62.23 T2.3
N$27  (5 unrouted)
N$28  (1 unrouted)
N$29
  Top 0.406: 75.88,20.79 R6.1 DAC2.6
N$31
  Top 0.406: DAC2.8 77.47,19.68 75.88,18.1 75.88,17.31 R40.1
N$32
  Top 0.406: DAC1.8 77.47,27.3 75.88,25.72 75.88,24.93 R41.1
N$33  (2 unrouted)
N$34
  Top 0.406: C35.1 73.85,40.77 73.66,40.96 | OSC1.3 73.66,43.02 73.66,40.96 | IC2.9 64.77,38.73 66.36,40.32 73.03,40.32 73.66,40.96
N$35
  Top 0.406: IC2.10 66.04,38.73 66.67,39.37 76.07,39.37 C22.1 77.47,44.13 76.52,45.09 OSC1.1
N$36  (1 unrouted)
N$37  (1 unrouted)
  Top 0.305: DAC2.5 77.79,21.59 77.47,21.91 | DAC1.5 77.79,29.21 77.15,29.84
  Top 0.406: 77.47,21.91 76.52,22.86 74.93,22.86 74.3,23.5 74.3,26.99 77.15,29.84 77.79,30.48 77.79,31.75 76.83,32.7 68.58,32.7 67.31,33.97 IC2.11
N$39  (1 unrouted)
N$41  (1 unrouted)
N$42  (1 unrouted)
N$45  (2 unrouted)
N$46  (2 unrouted)
N$47  (1 unrouted)
N$48  (2 unrouted)
PGC  (1 unrouted)
PGD  (1 unrouted)
RXD  (1 unrouted)
TXD  (1 unrouted)
VBAT  (via drill 0.4 pad 0.81)  (8 unrouted)
  Top 0.406: R16.1 38.58,59.21 37.15,60.64 35.24,60.64 34.29,61.59 34.29,62.87 33.66,63.5 30.48,63.5 29.84,64.14 29.84,66.04 v29.21,66.67
  other vias: 15.24,66.67 17.78,70.48 15.24,76.83 15.24,75.56 15.24,74.3 15.24,73.03 15.24,71.75 15.24,70.48 15.24,69.22 15.24,67.94 16.51,66.67 16.51,67.94 16.51,69.22 16.51,70.48 16.51,71.75 17.78,66.67 17.78,67.94 17.78,69.22 19.05,67.94 19.05,66.67 20.32,66.67 20.32,67.94 21.59,66.67 21.59,67.94 22.86,66.67 22.86,67.94 24.13,66.67 24.13,67.94 25.4,66.67 25.4,67.94 26.67,66.67 26.67,67.94 27.94,66.67 27.94,67.94 29.21,67.94 30.48,66.67 30.48,67.94 31.75,66.67 31.75,67.94 31.75,69.22 31.75,70.48 31.75,71.75 31.75,73.03 31.75,74.3 31.75,75.56 31.75,76.83 33.02,66.67 33.02,67.94 33.02,69.22 33.02,70.48 33.02,71.75 33.02,73.03 33.02,74.3 33.02,75.56 33.02,76.83 34.29,66.67 34.29,67.94 34.29,69.22 34.29,70.48 34.29,71.75 34.29,73.03 34.29,74.3 34.29,75.56 34.29,76.83 17.78,71.75 17.78,73.03 17.78,74.3 17.78,75.56 17.78,76.83 16.51,73.03 16.51,74.3 16.51,75.56 16.51,76.83 16.51,78.11 17.78,78.11 19.05,78.11 20.32,78.11 21.59,78.11 22.86,78.11 24.13,78.11 25.4,78.11 26.67,78.11 27.94,78.11 29.21,78.11 30.48,78.11 31.75,78.11 33.02,78.11
  pour Bottom (isolate 0.406, no thermals): 13.97,78.74 13.97,66.04 35.56,66.04 35.56,78.74
  pour Top (isolate 0.406, no thermals): 13.97,66.04 30.48,66.04 30.48,66.67 35.56,66.67 35.56,78.74 13.97,78.74
VBAT_AD  (via drill 0.4 pad 0.81)  (1 unrouted)
  Top 0.406: 52.07,40.64 55.24,40.64 57.15,38.73 IC2.3 57.15,36.51 54.29,33.66 54.29,30.03 C19.1 | 48.9,48.9 v48.9,50.8 | v48.9,54.61 48.26,55.24 R20.2
  Bottom 0.406: v48.9,50.8 v48.9,54.61
VCC  (9 unrouted)
  Top 0.61: 51.12,63.82 IC4.3 50.8,62.23 54.61,62.23 | 54.61,62.23 58.42,62.23 | 58.42,62.23 62.1,62.23 C47.1 | C41.1 54.61,62.23 | C5.1 58.42,62.23
VDD  (4 unrouted)
  Top 0.406: IC2.20 64.77,49.66 C11.1
VOPA_AD  (3 unrouted)
  Top 0.406: C37.1 55.75,33.21 58.42,35.88 IC2.4 58.42,38.73 55.56,41.59 52.39,41.59
VP12_AD  (1 unrouted)
  Top 0.406: R35.1 54.61,24.77 55.24,25.4 | 55.24,25.4 55.75,25.91 C21.1 55.75,29.4 57.15,30.8 57.15,33.34 59.69,35.88 IC2.5 59.69,38.73 55.88,42.55 54.29,42.55 | R34.2 55.73,24.92 55.24,25.4
VREF_ADC  (1 unrouted)
  Top 0.406: REF1.2 63.42,19.76 64.27,20.6 C27.1 C26.1 62.87,29.98 62.87,33.66 61.91,34.61 61.91,35.88 62.23,36.2 IC2.7
VS_CHG  (3 unrouted)
XEN_CHRG  (1 unrouted)